# EasyEDA Pro project Module_DIY.eprj

# Schematic Module4_Schematic
Create Date: 2024-08-10; Page Name: P1; Project Name: Module_DIY; Schematic Name: Module4_Schematic; Update Date: 2024-08-10; Company: 嘉立创EDA; Page Size: A4; Version: V1.0
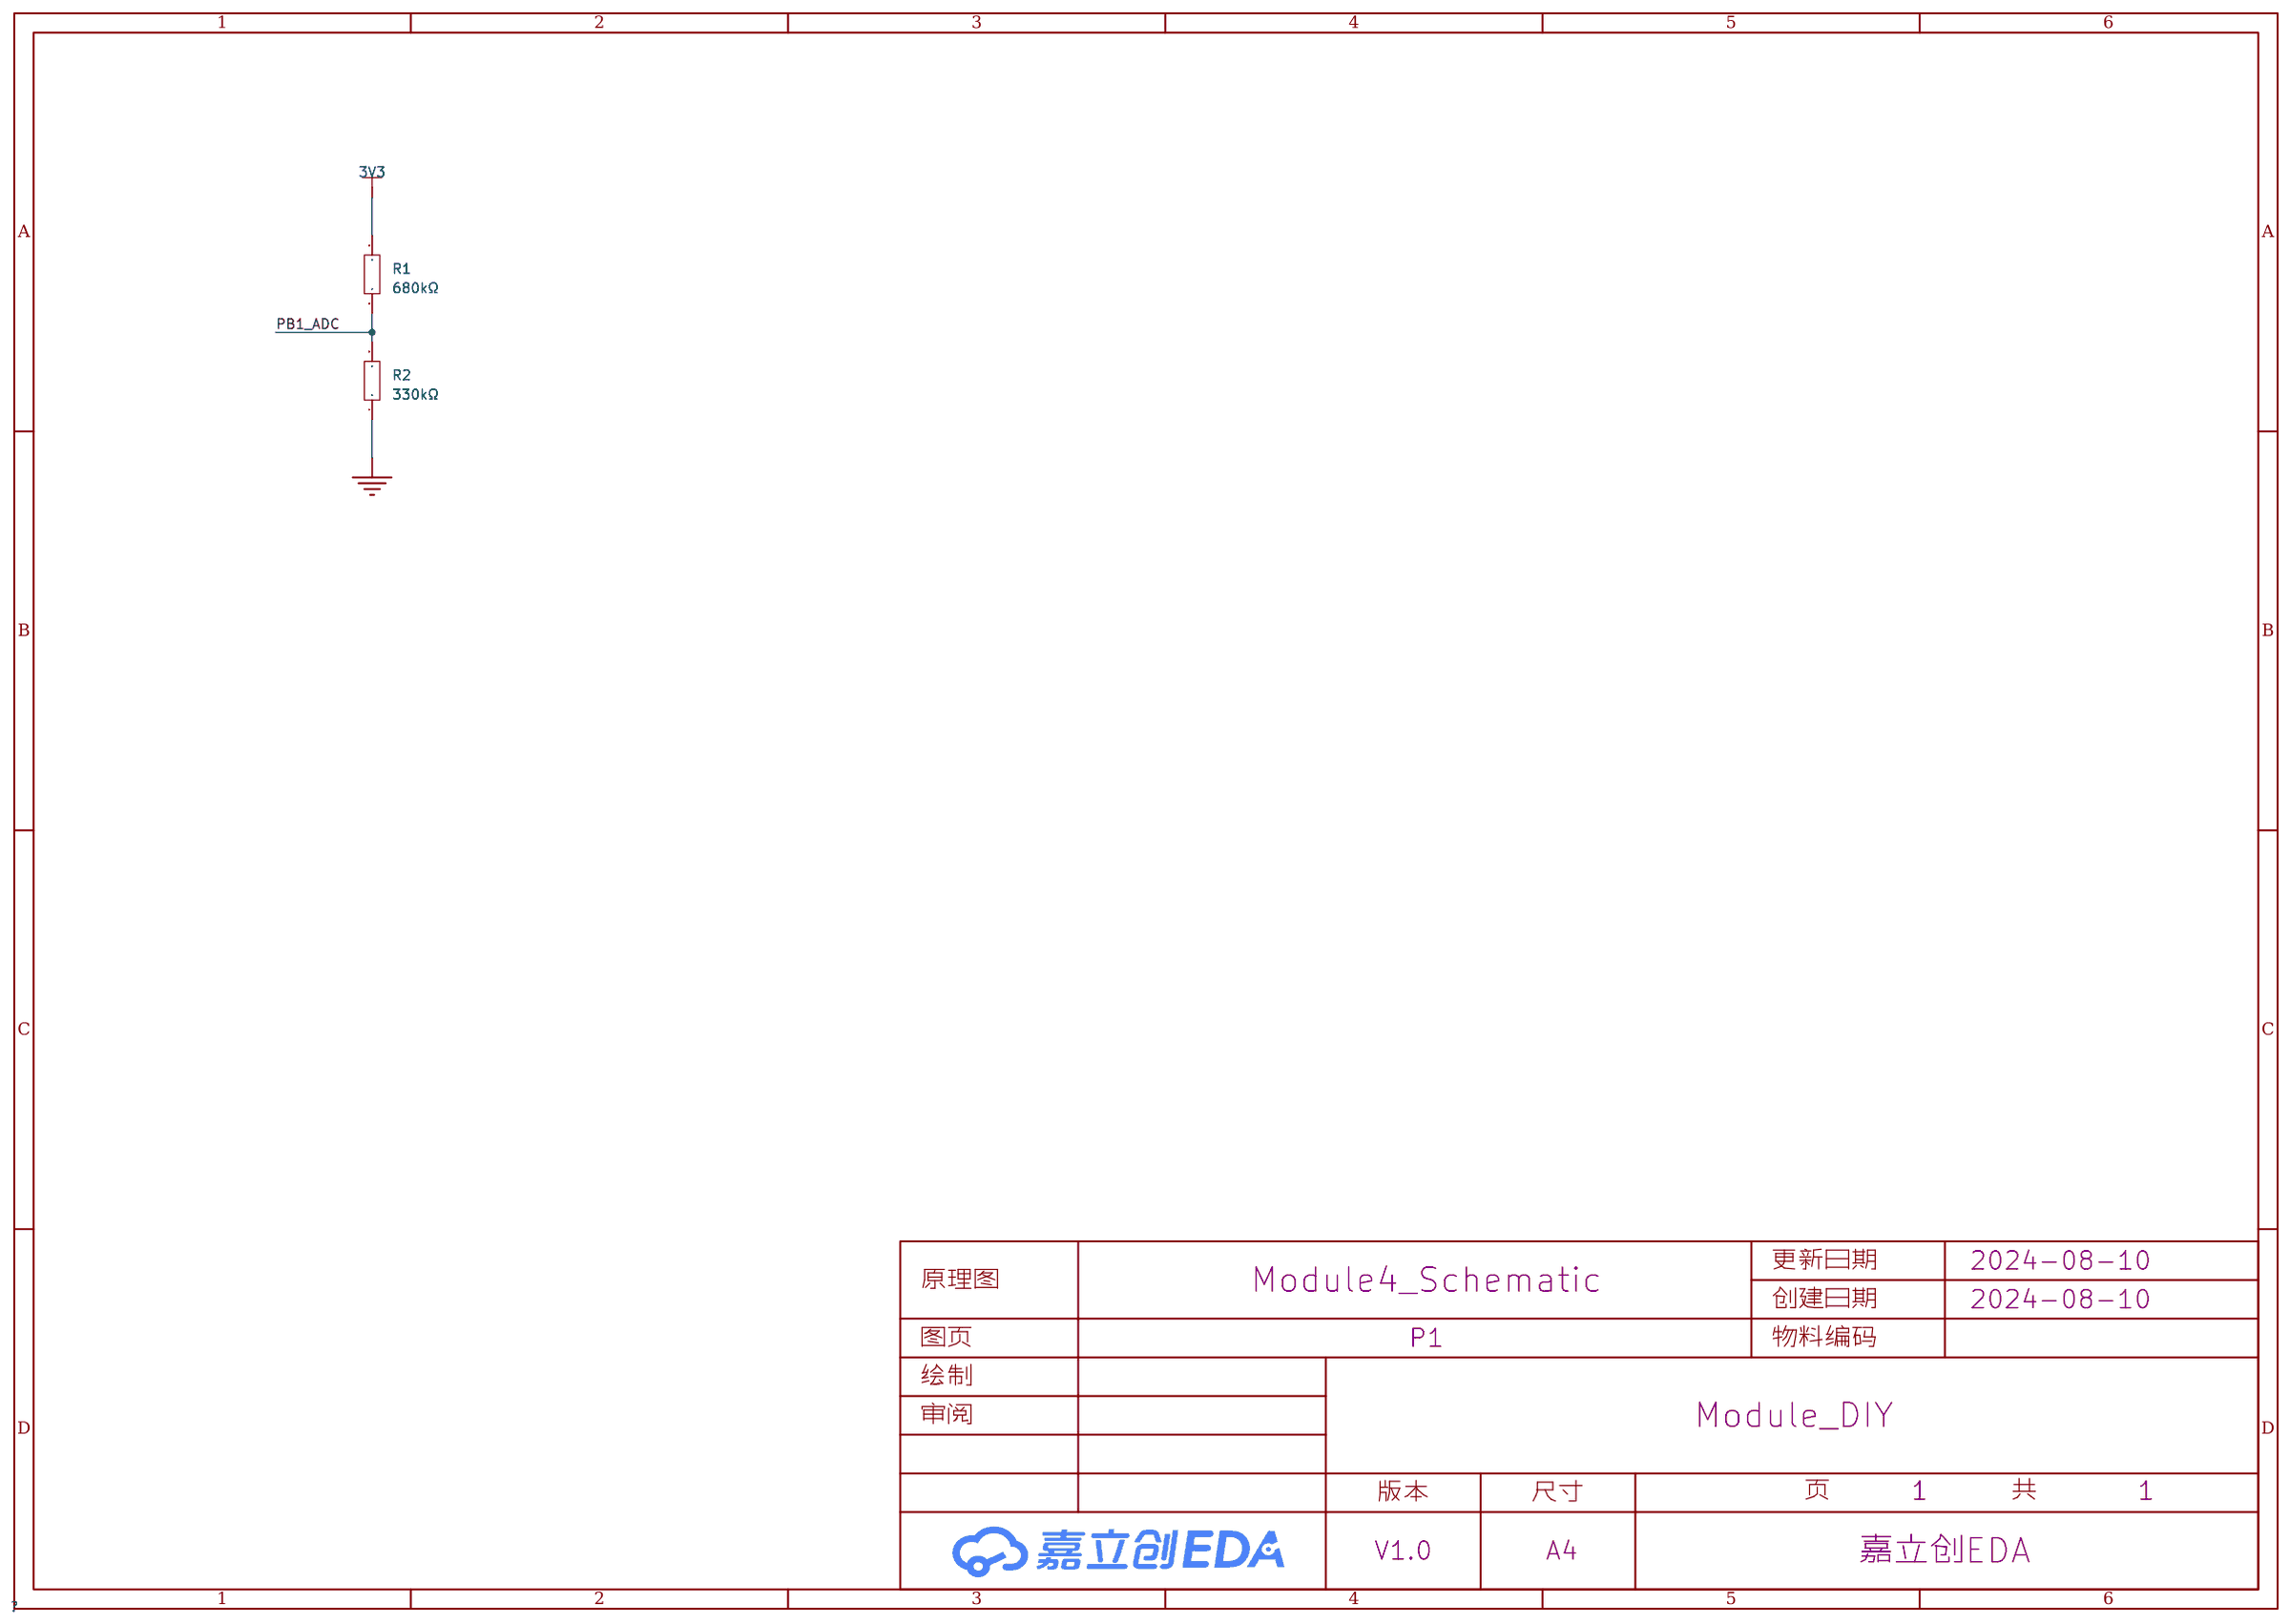
[diagram p0: schematic sheet]

## Parts
R1  680kΩ  [R0603]
R2  330kΩ  [R0603]

## Library data of the parts
R1 R2 = 0603WAF9103T5E: 电阻类型:厚膜电阻;阻值:910kΩ;精度:±1%;功率:100mW;最大工作电压:75V;温度系数:±100ppm/℃;; LCSC Part Name: 910kΩ ±1% 100mW 厚膜电阻; Supplier Part: C23263; Manufacturer: UNI-ROYAL(厚声); Supplier Footprint: 0603; JLCPCB Part Class: 扩展库; Datasheet: https://atta.szlcsc.com/upload/public/pdf/source/20200306/C422600_1E6D84923E4A46A82E41ADD87F860B5C.pdf; Supplier: LCSC; Type: 厚膜电阻; Tolerance: ±1%; Power(Watts): 100mW; Overload Voltage (Max): 75V; Temperature Coefficient: ±100ppm/℃; Operating Temperature Range: -55℃~+155℃

## Nets
3V3: R1.1
GND: R2.1
PB1_ADC: R1.2 R2.2

# Schematic Module5_Schematic
Create Date: 2024-08-10; Page Name: P1; Project Name: Module_DIY; Schematic Name: Module5_Schematic; Update Date: 2024-08-11; Company: 嘉立创EDA; Page Size: A4; Version: V1.0
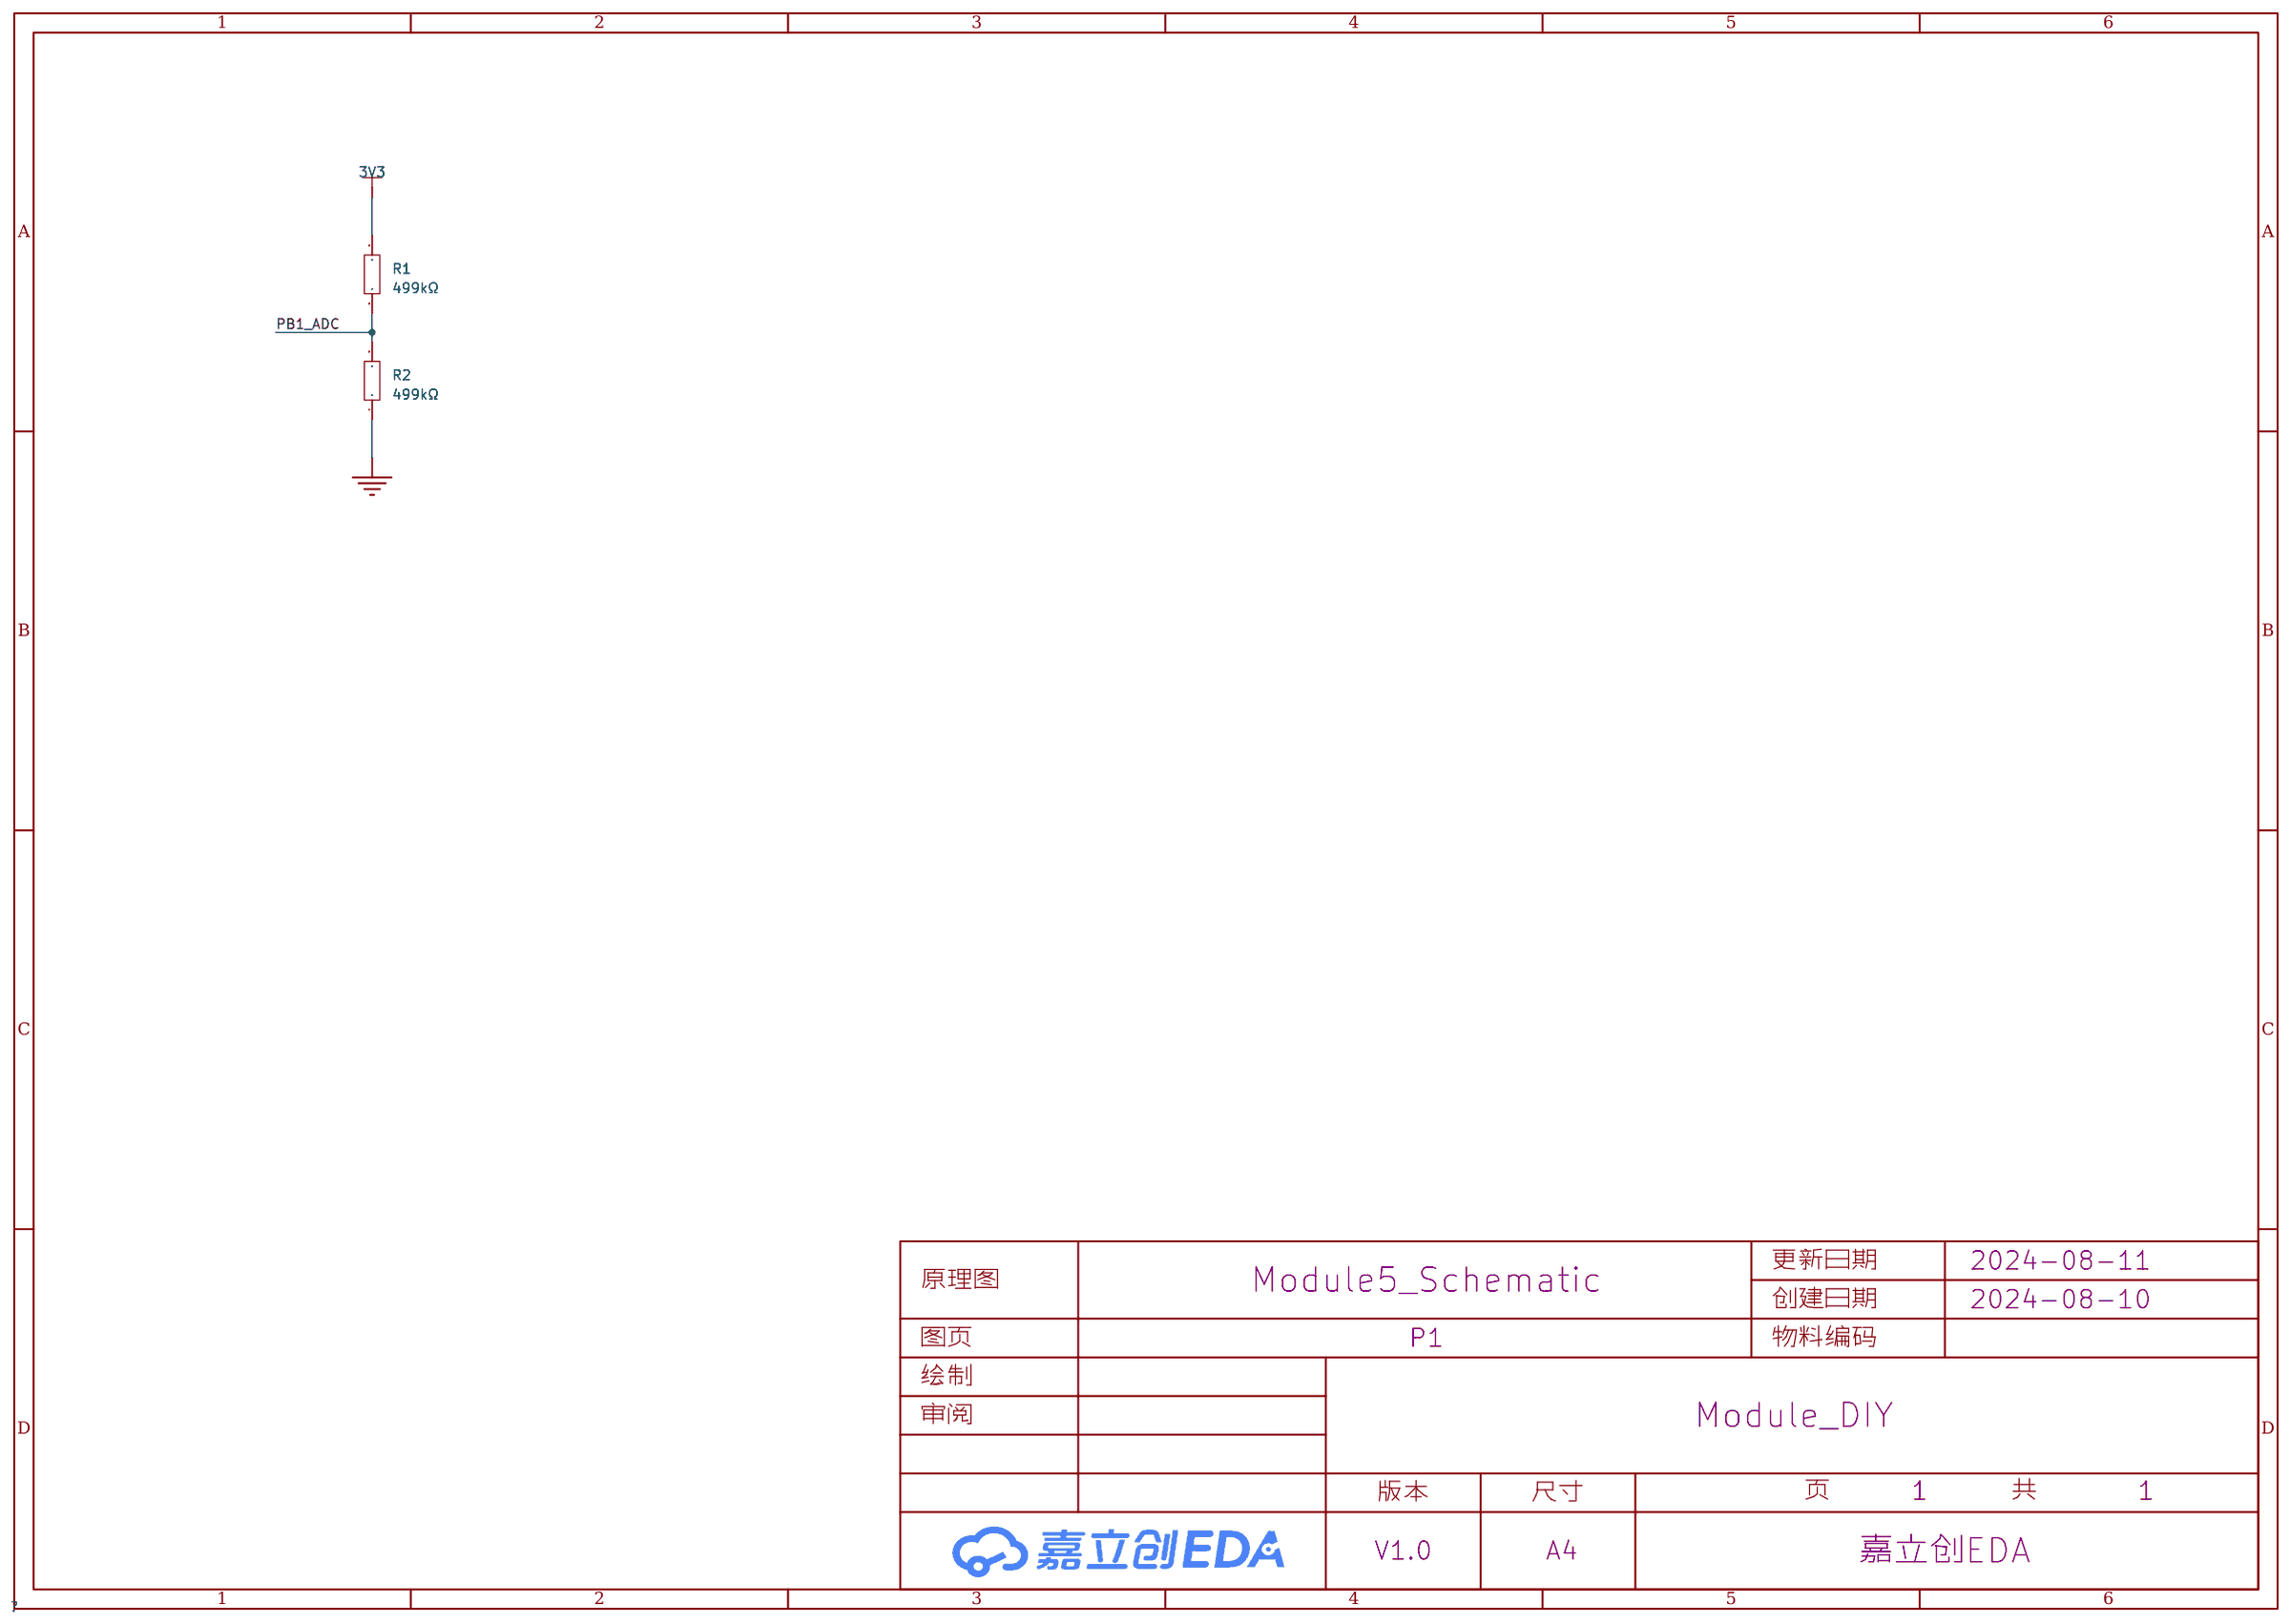
[diagram p1: schematic sheet]

## Parts
R1  499kΩ  [R0603]
R2  499kΩ  [R0603]

## Library data of the parts
R1 R2 = 0603WAF9103T5E: 电阻类型:厚膜电阻;阻值:910kΩ;精度:±1%;功率:100mW;最大工作电压:75V;温度系数:±100ppm/℃;; LCSC Part Name: 910kΩ ±1% 100mW 厚膜电阻; Supplier Part: C23263; Manufacturer: UNI-ROYAL(厚声); Supplier Footprint: 0603; JLCPCB Part Class: 扩展库; Datasheet: https://atta.szlcsc.com/upload/public/pdf/source/20200306/C422600_1E6D84923E4A46A82E41ADD87F860B5C.pdf; Supplier: LCSC; Type: 厚膜电阻; Tolerance: ±1%; Power(Watts): 100mW; Overload Voltage (Max): 75V; Temperature Coefficient: ±100ppm/℃; Operating Temperature Range: -55℃~+155℃

## Nets
3V3: R1.1
GND: R2.1
PB1_ADC: R1.2 R2.2

# Schematic Module6_Schematic
Create Date: 2024-08-10; Page Name: P1; Project Name: Module_DIY; Schematic Name: Module6_Schematic; Update Date: 2024-08-11; Company: 嘉立创EDA; Page Size: A4; Version: V1.0
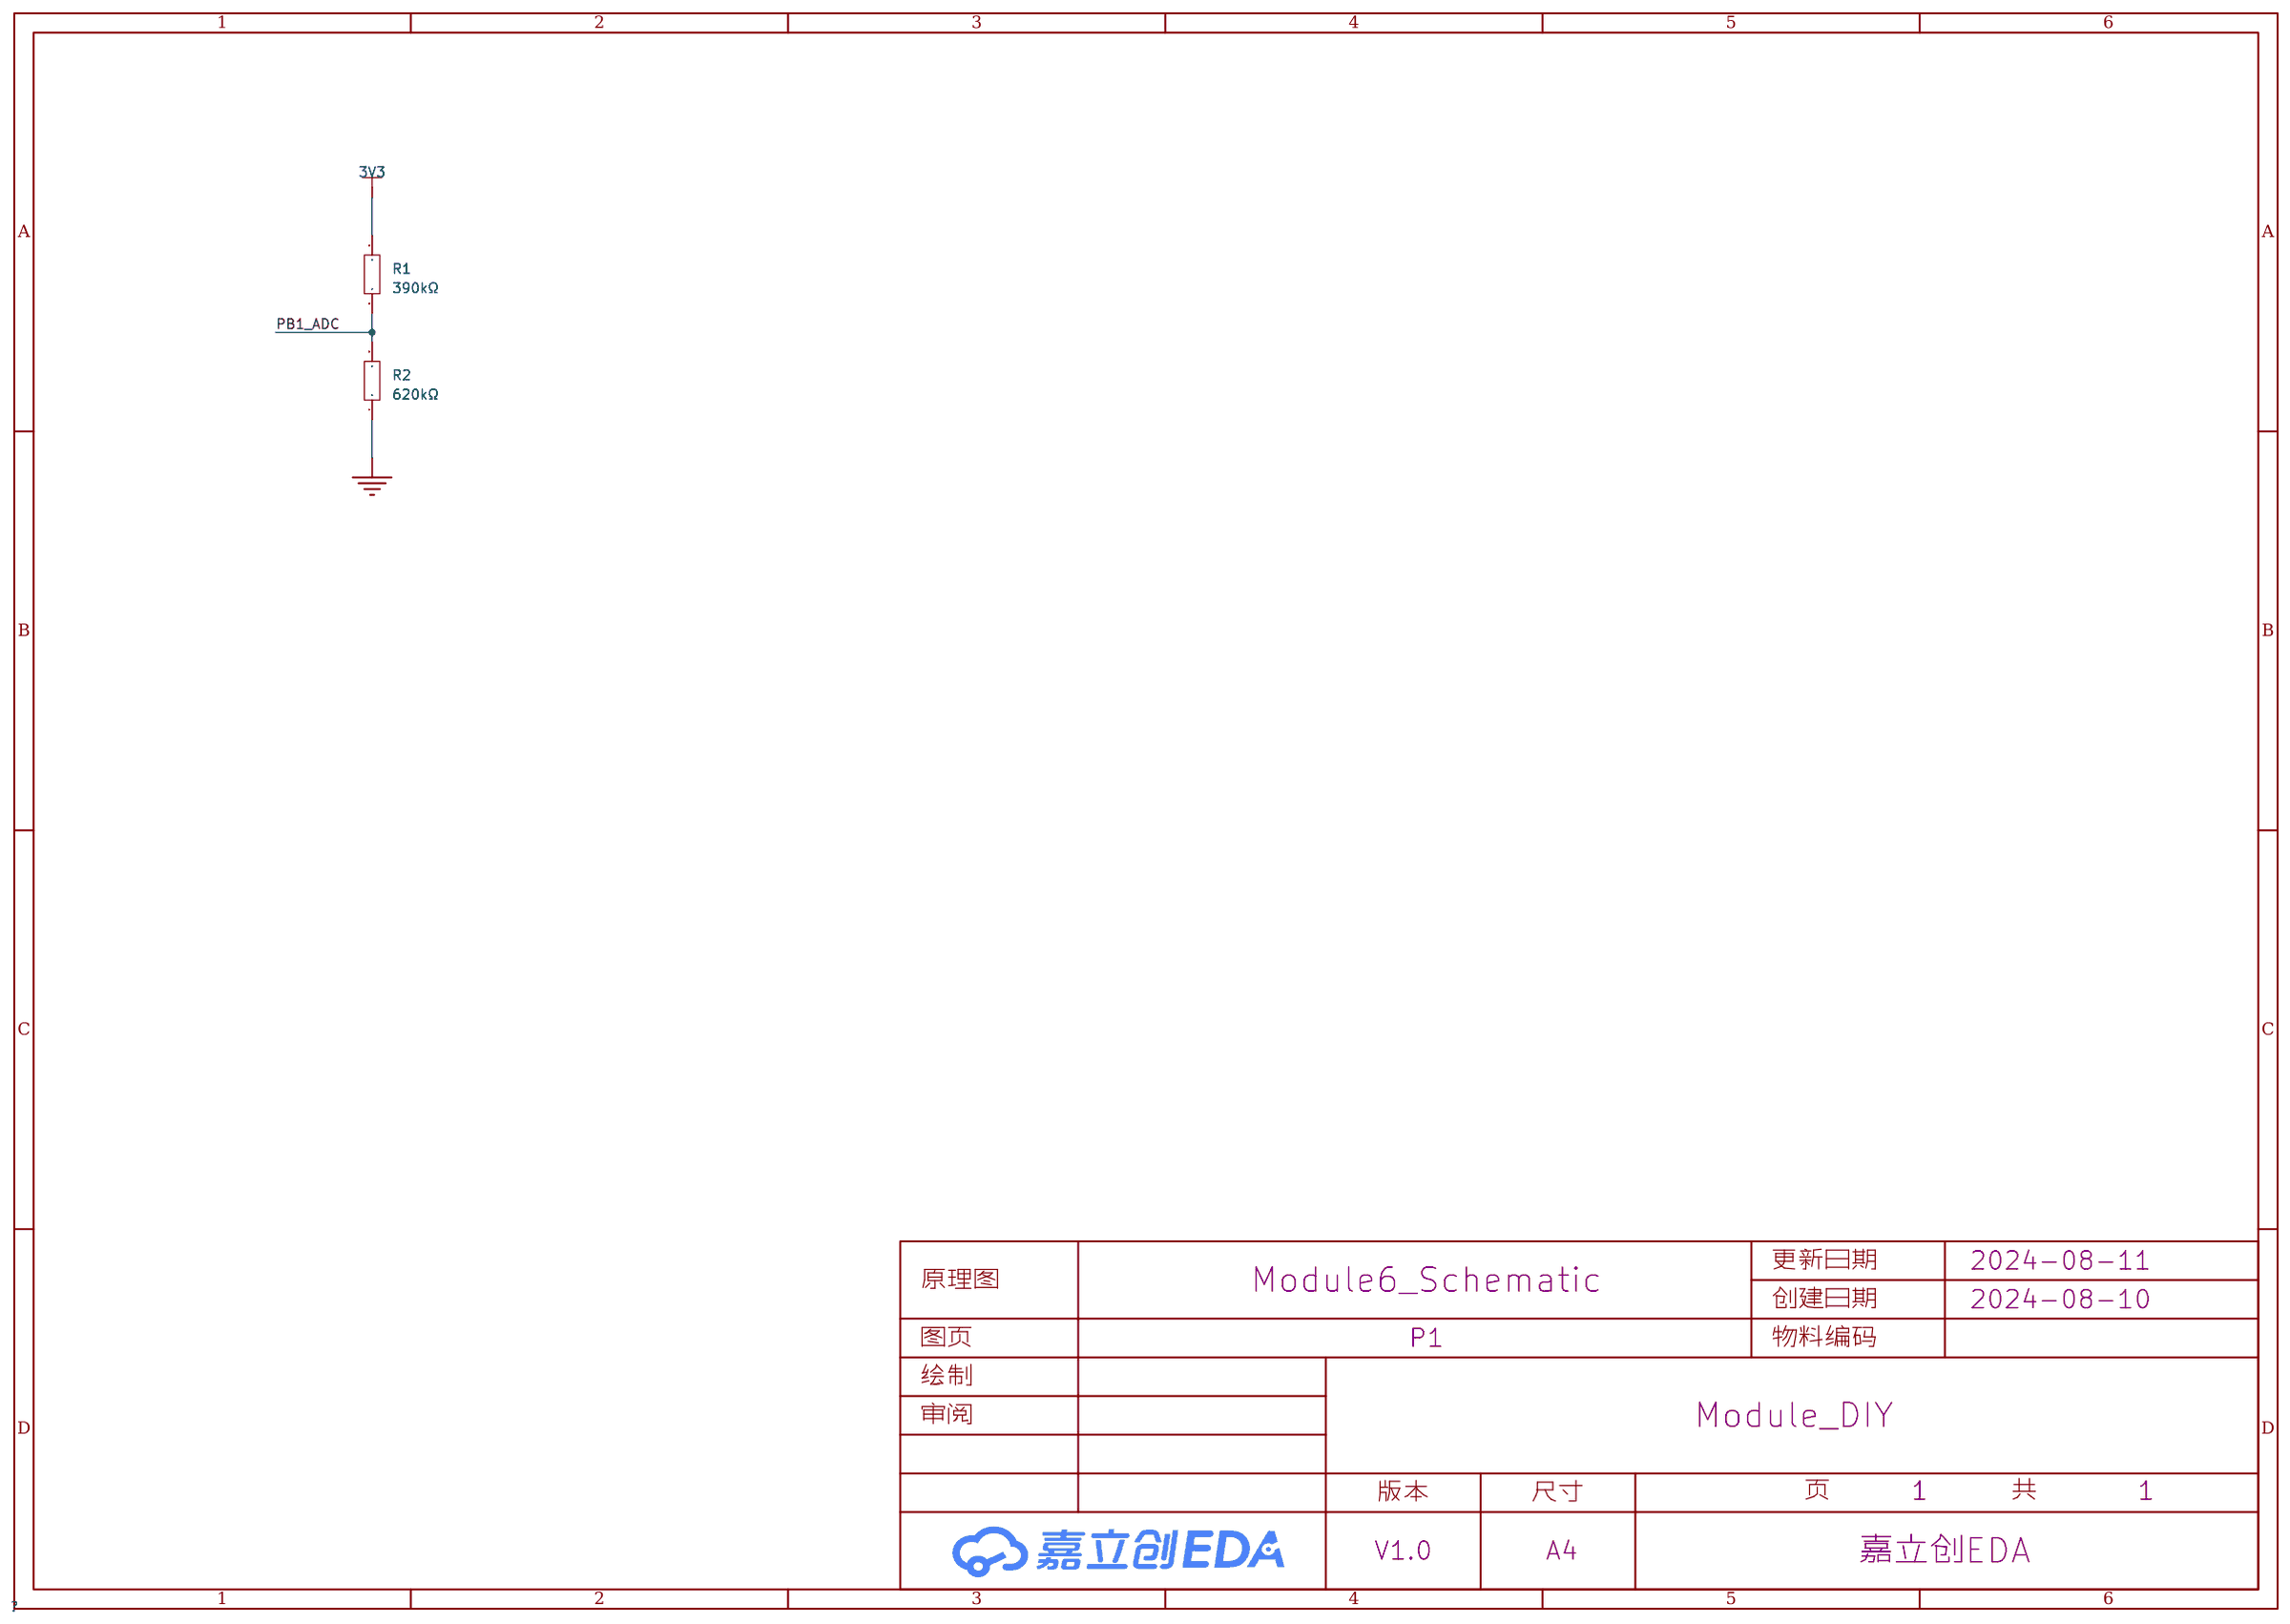
[diagram p2: schematic sheet]

## Parts
R1  390kΩ  [R0603]
R2  620kΩ  [R0603]

## Library data of the parts
R1 R2 = 0603WAF9103T5E: 电阻类型:厚膜电阻;阻值:910kΩ;精度:±1%;功率:100mW;最大工作电压:75V;温度系数:±100ppm/℃;; LCSC Part Name: 910kΩ ±1% 100mW 厚膜电阻; Supplier Part: C23263; Manufacturer: UNI-ROYAL(厚声); Supplier Footprint: 0603; JLCPCB Part Class: 扩展库; Datasheet: https://atta.szlcsc.com/upload/public/pdf/source/20200306/C422600_1E6D84923E4A46A82E41ADD87F860B5C.pdf; Supplier: LCSC; Type: 厚膜电阻; Tolerance: ±1%; Power(Watts): 100mW; Overload Voltage (Max): 75V; Temperature Coefficient: ±100ppm/℃; Operating Temperature Range: -55℃~+155℃

## Nets
3V3: R1.1
GND: R2.1
PB1_ADC: R1.2 R2.2

# Schematic Module7_Schematic
Create Date: 2024-08-10; Page Name: P1; Project Name: Module_DIY; Schematic Name: Module7_Schematic; Update Date: 2024-08-11; Company: 嘉立创EDA; Page Size: A4; Version: V1.0
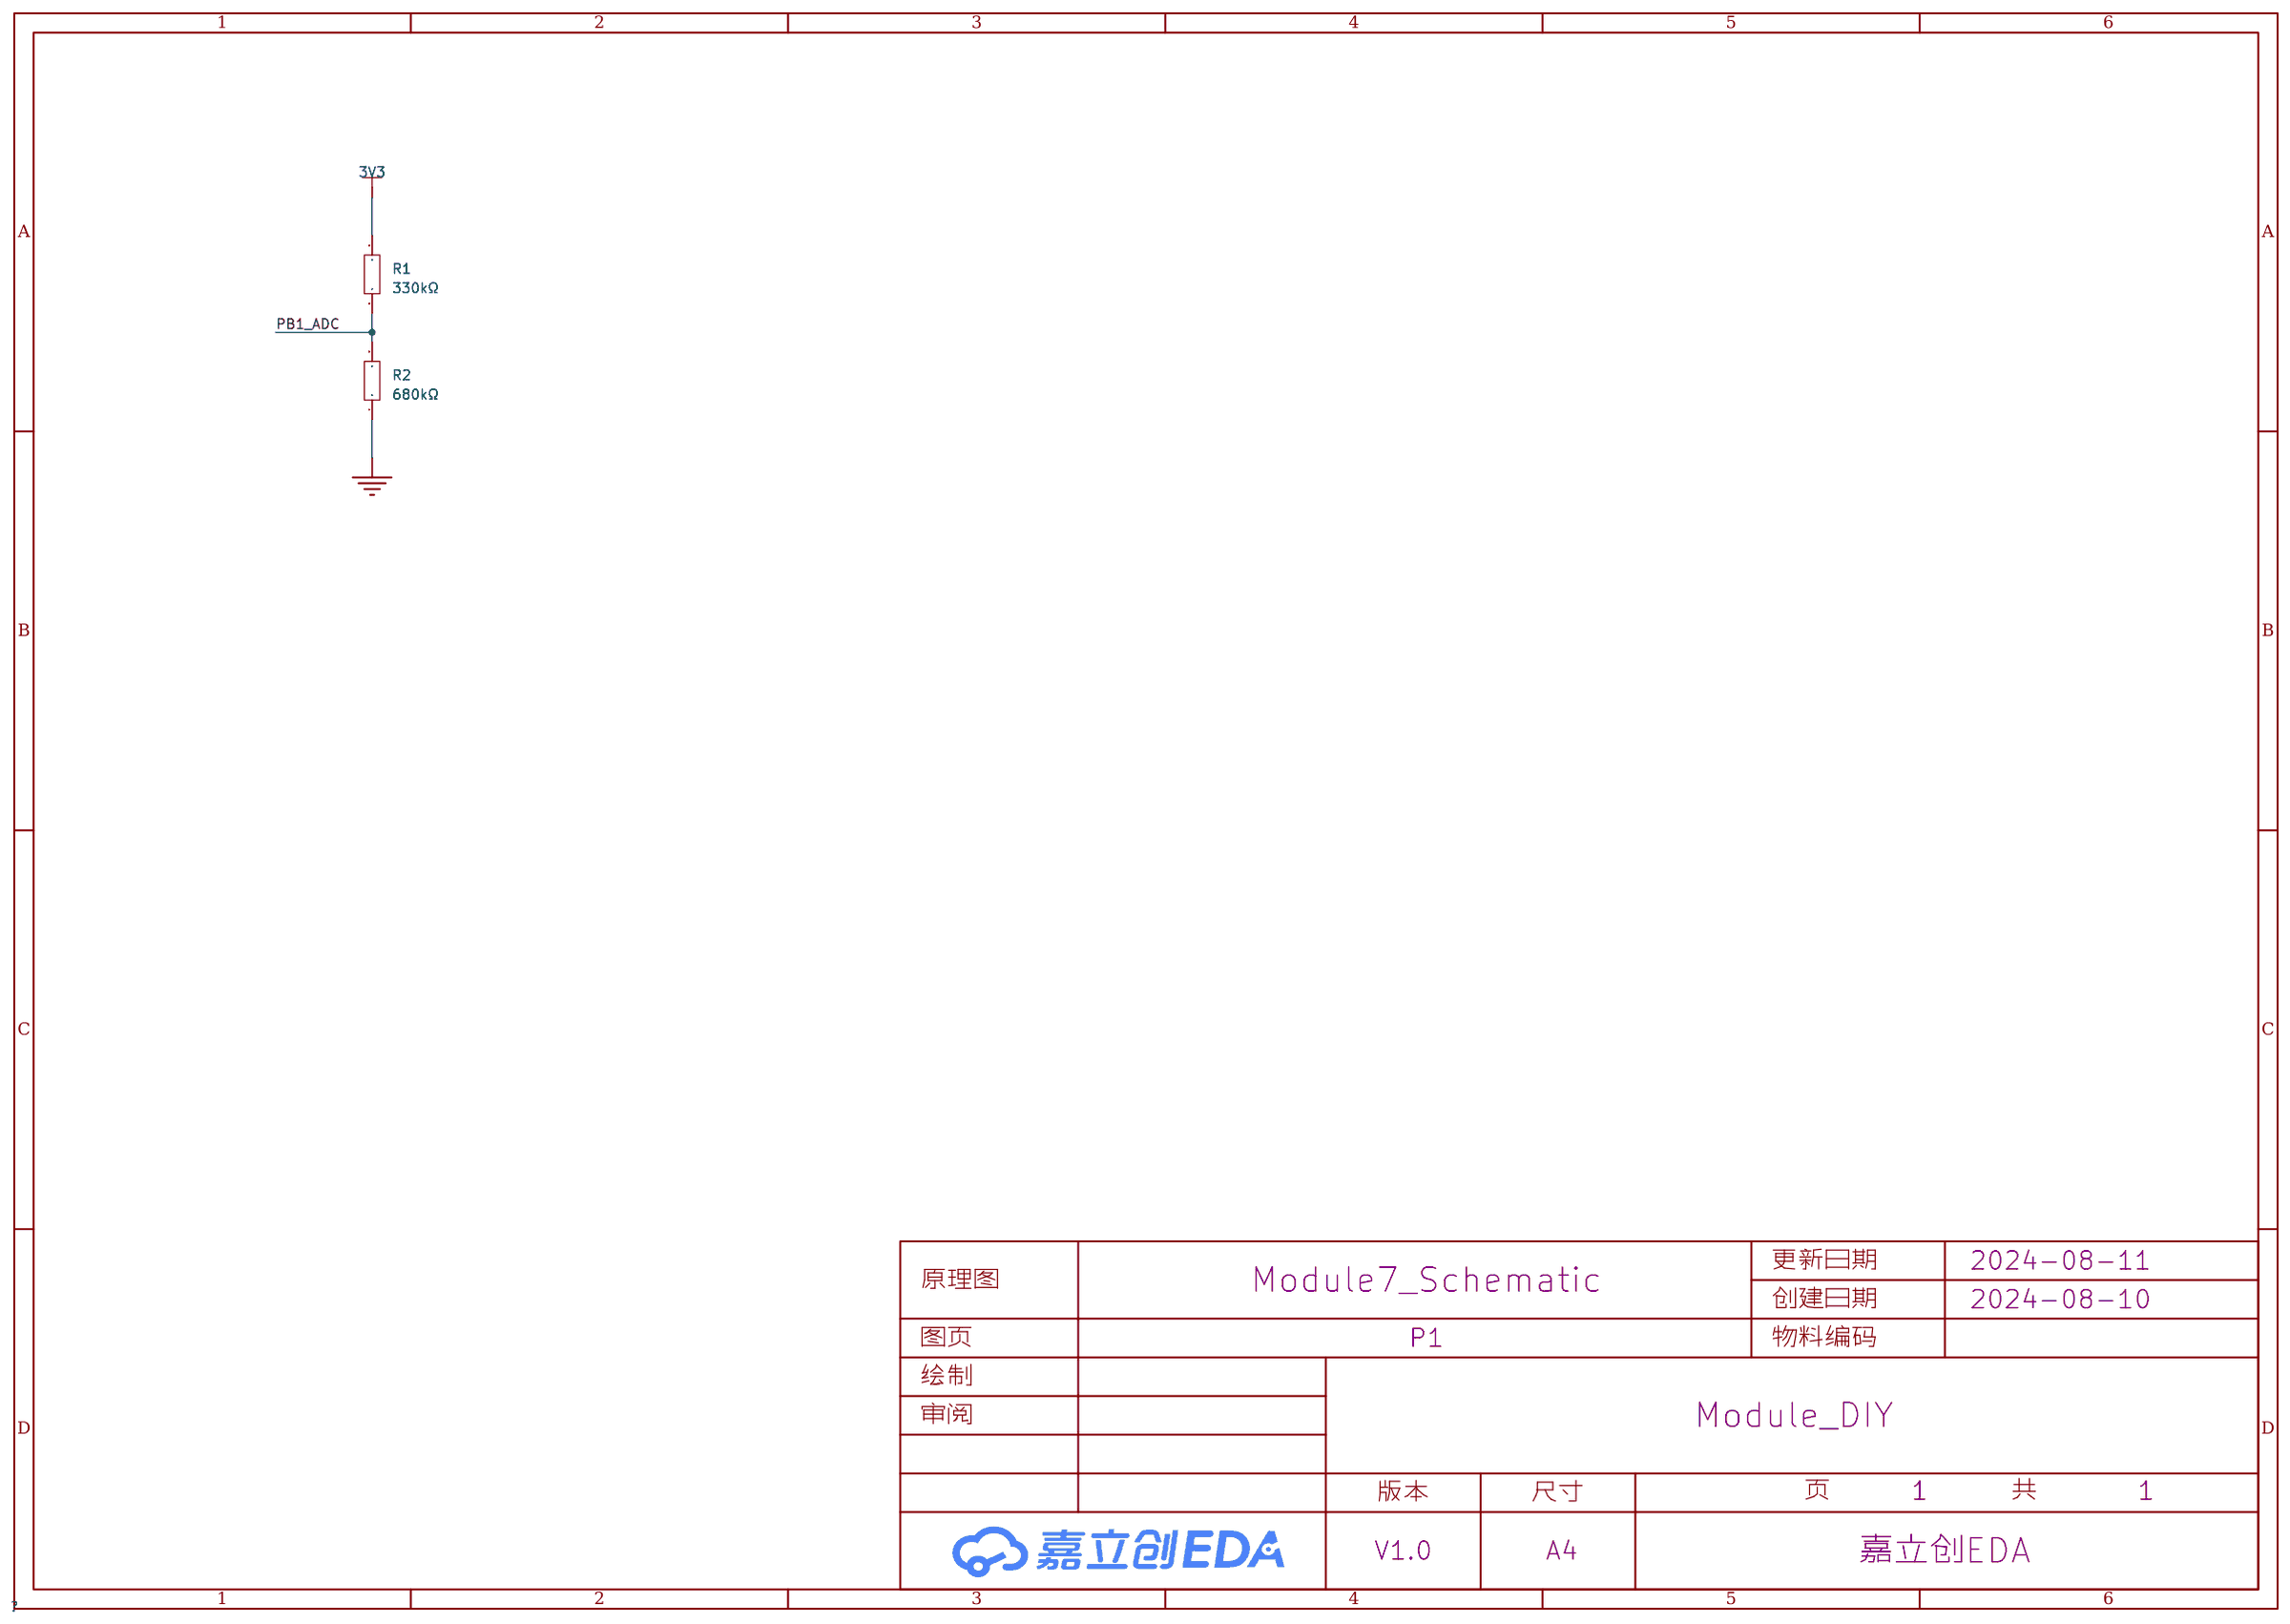
[diagram p3: schematic sheet]

## Parts
R1  330kΩ  [R0603]
R2  680kΩ  [R0603]

## Library data of the parts
R1 R2 = 0603WAF9103T5E: 电阻类型:厚膜电阻;阻值:910kΩ;精度:±1%;功率:100mW;最大工作电压:75V;温度系数:±100ppm/℃;; LCSC Part Name: 910kΩ ±1% 100mW 厚膜电阻; Supplier Part: C23263; Manufacturer: UNI-ROYAL(厚声); Supplier Footprint: 0603; JLCPCB Part Class: 扩展库; Datasheet: https://atta.szlcsc.com/upload/public/pdf/source/20200306/C422600_1E6D84923E4A46A82E41ADD87F860B5C.pdf; Supplier: LCSC; Type: 厚膜电阻; Tolerance: ±1%; Power(Watts): 100mW; Overload Voltage (Max): 75V; Temperature Coefficient: ±100ppm/℃; Operating Temperature Range: -55℃~+155℃

## Nets
3V3: R1.1
GND: R2.1
PB1_ADC: R1.2 R2.2

# Schematic Module8_Schematic
Create Date: 2024-08-10; Page Name: P1; Project Name: Module_DIY; Schematic Name: Module8_Schematic; Update Date: 2024-08-11; Company: 嘉立创EDA; Page Size: A4; Version: V1.0
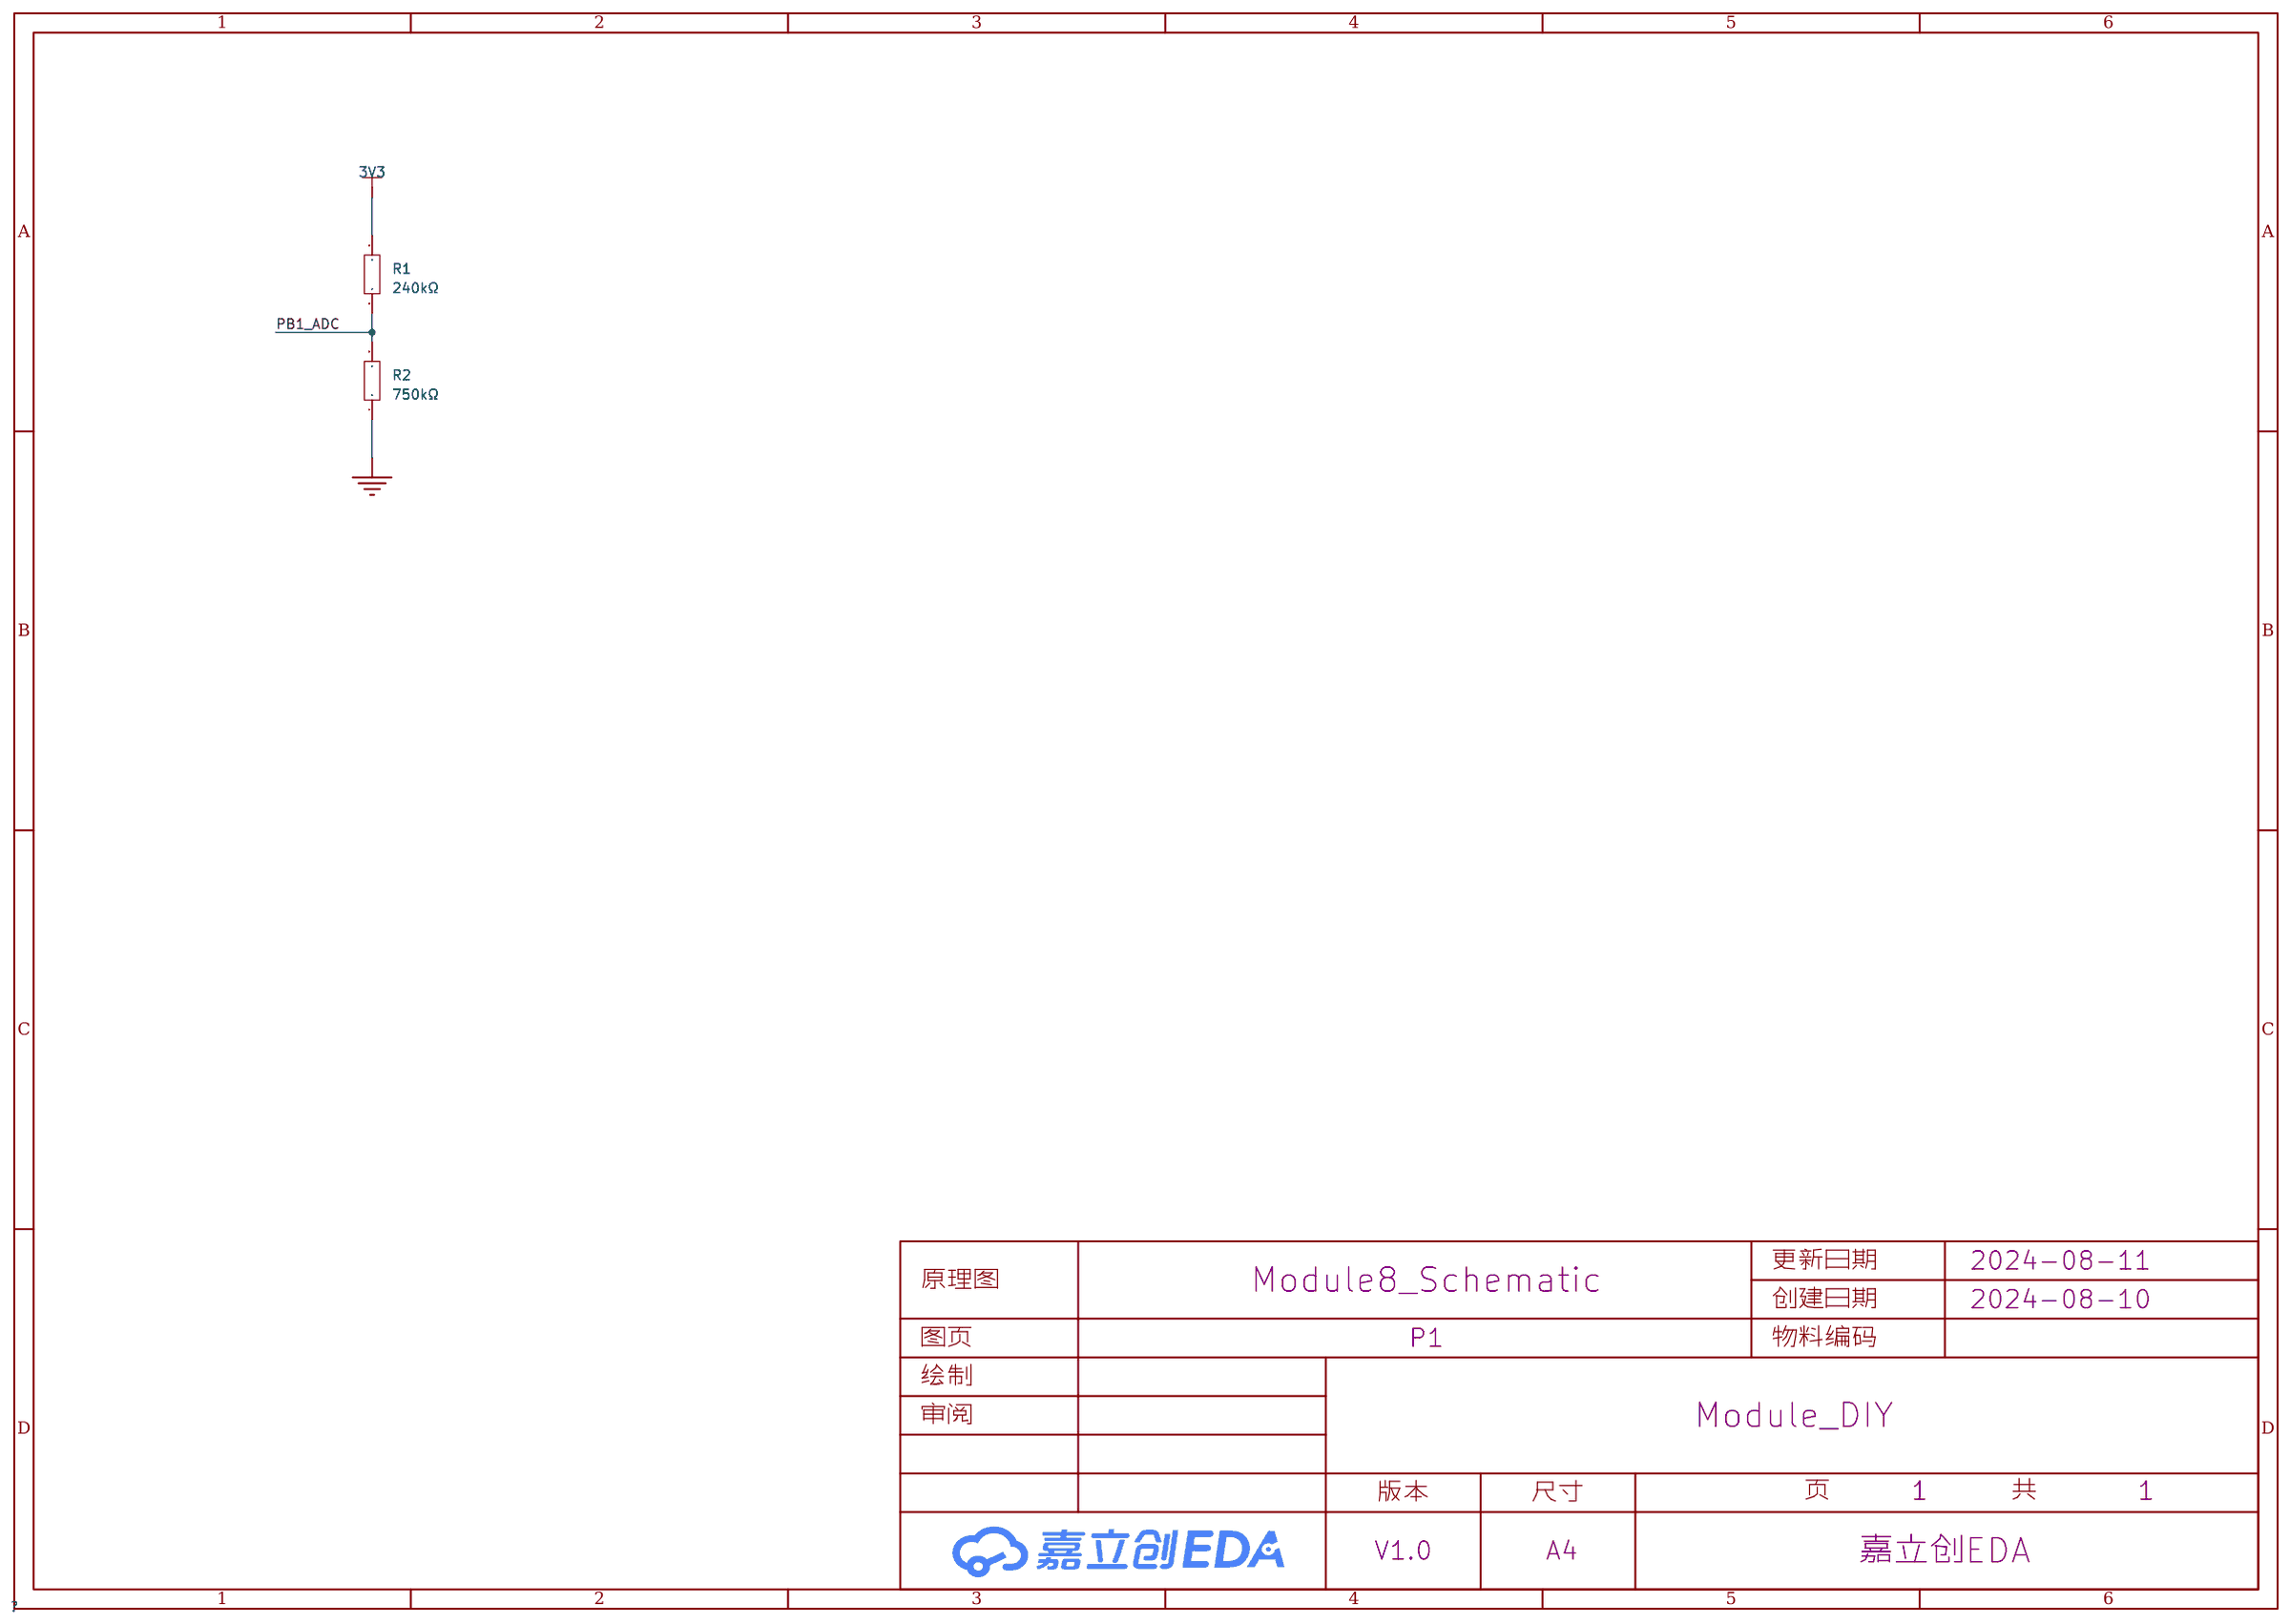
[diagram p4: schematic sheet]

## Parts
R1  240kΩ  [R0603]
R2  750kΩ  [R0603]

## Library data of the parts
R1 R2 = 0603WAF9103T5E: 电阻类型:厚膜电阻;阻值:910kΩ;精度:±1%;功率:100mW;最大工作电压:75V;温度系数:±100ppm/℃;; LCSC Part Name: 910kΩ ±1% 100mW 厚膜电阻; Supplier Part: C23263; Manufacturer: UNI-ROYAL(厚声); Supplier Footprint: 0603; JLCPCB Part Class: 扩展库; Datasheet: https://atta.szlcsc.com/upload/public/pdf/source/20200306/C422600_1E6D84923E4A46A82E41ADD87F860B5C.pdf; Supplier: LCSC; Type: 厚膜电阻; Tolerance: ±1%; Power(Watts): 100mW; Overload Voltage (Max): 75V; Temperature Coefficient: ±100ppm/℃; Operating Temperature Range: -55℃~+155℃

## Nets
3V3: R1.1
GND: R2.1
PB1_ADC: R1.2 R2.2

# Schematic Module9_Schematic
Create Date: 2024-08-10; Page Name: P1; Project Name: Module_DIY; Schematic Name: Module9_Schematic; Update Date: 2024-08-11; Company: 嘉立创EDA; Page Size: A4; Version: V1.0
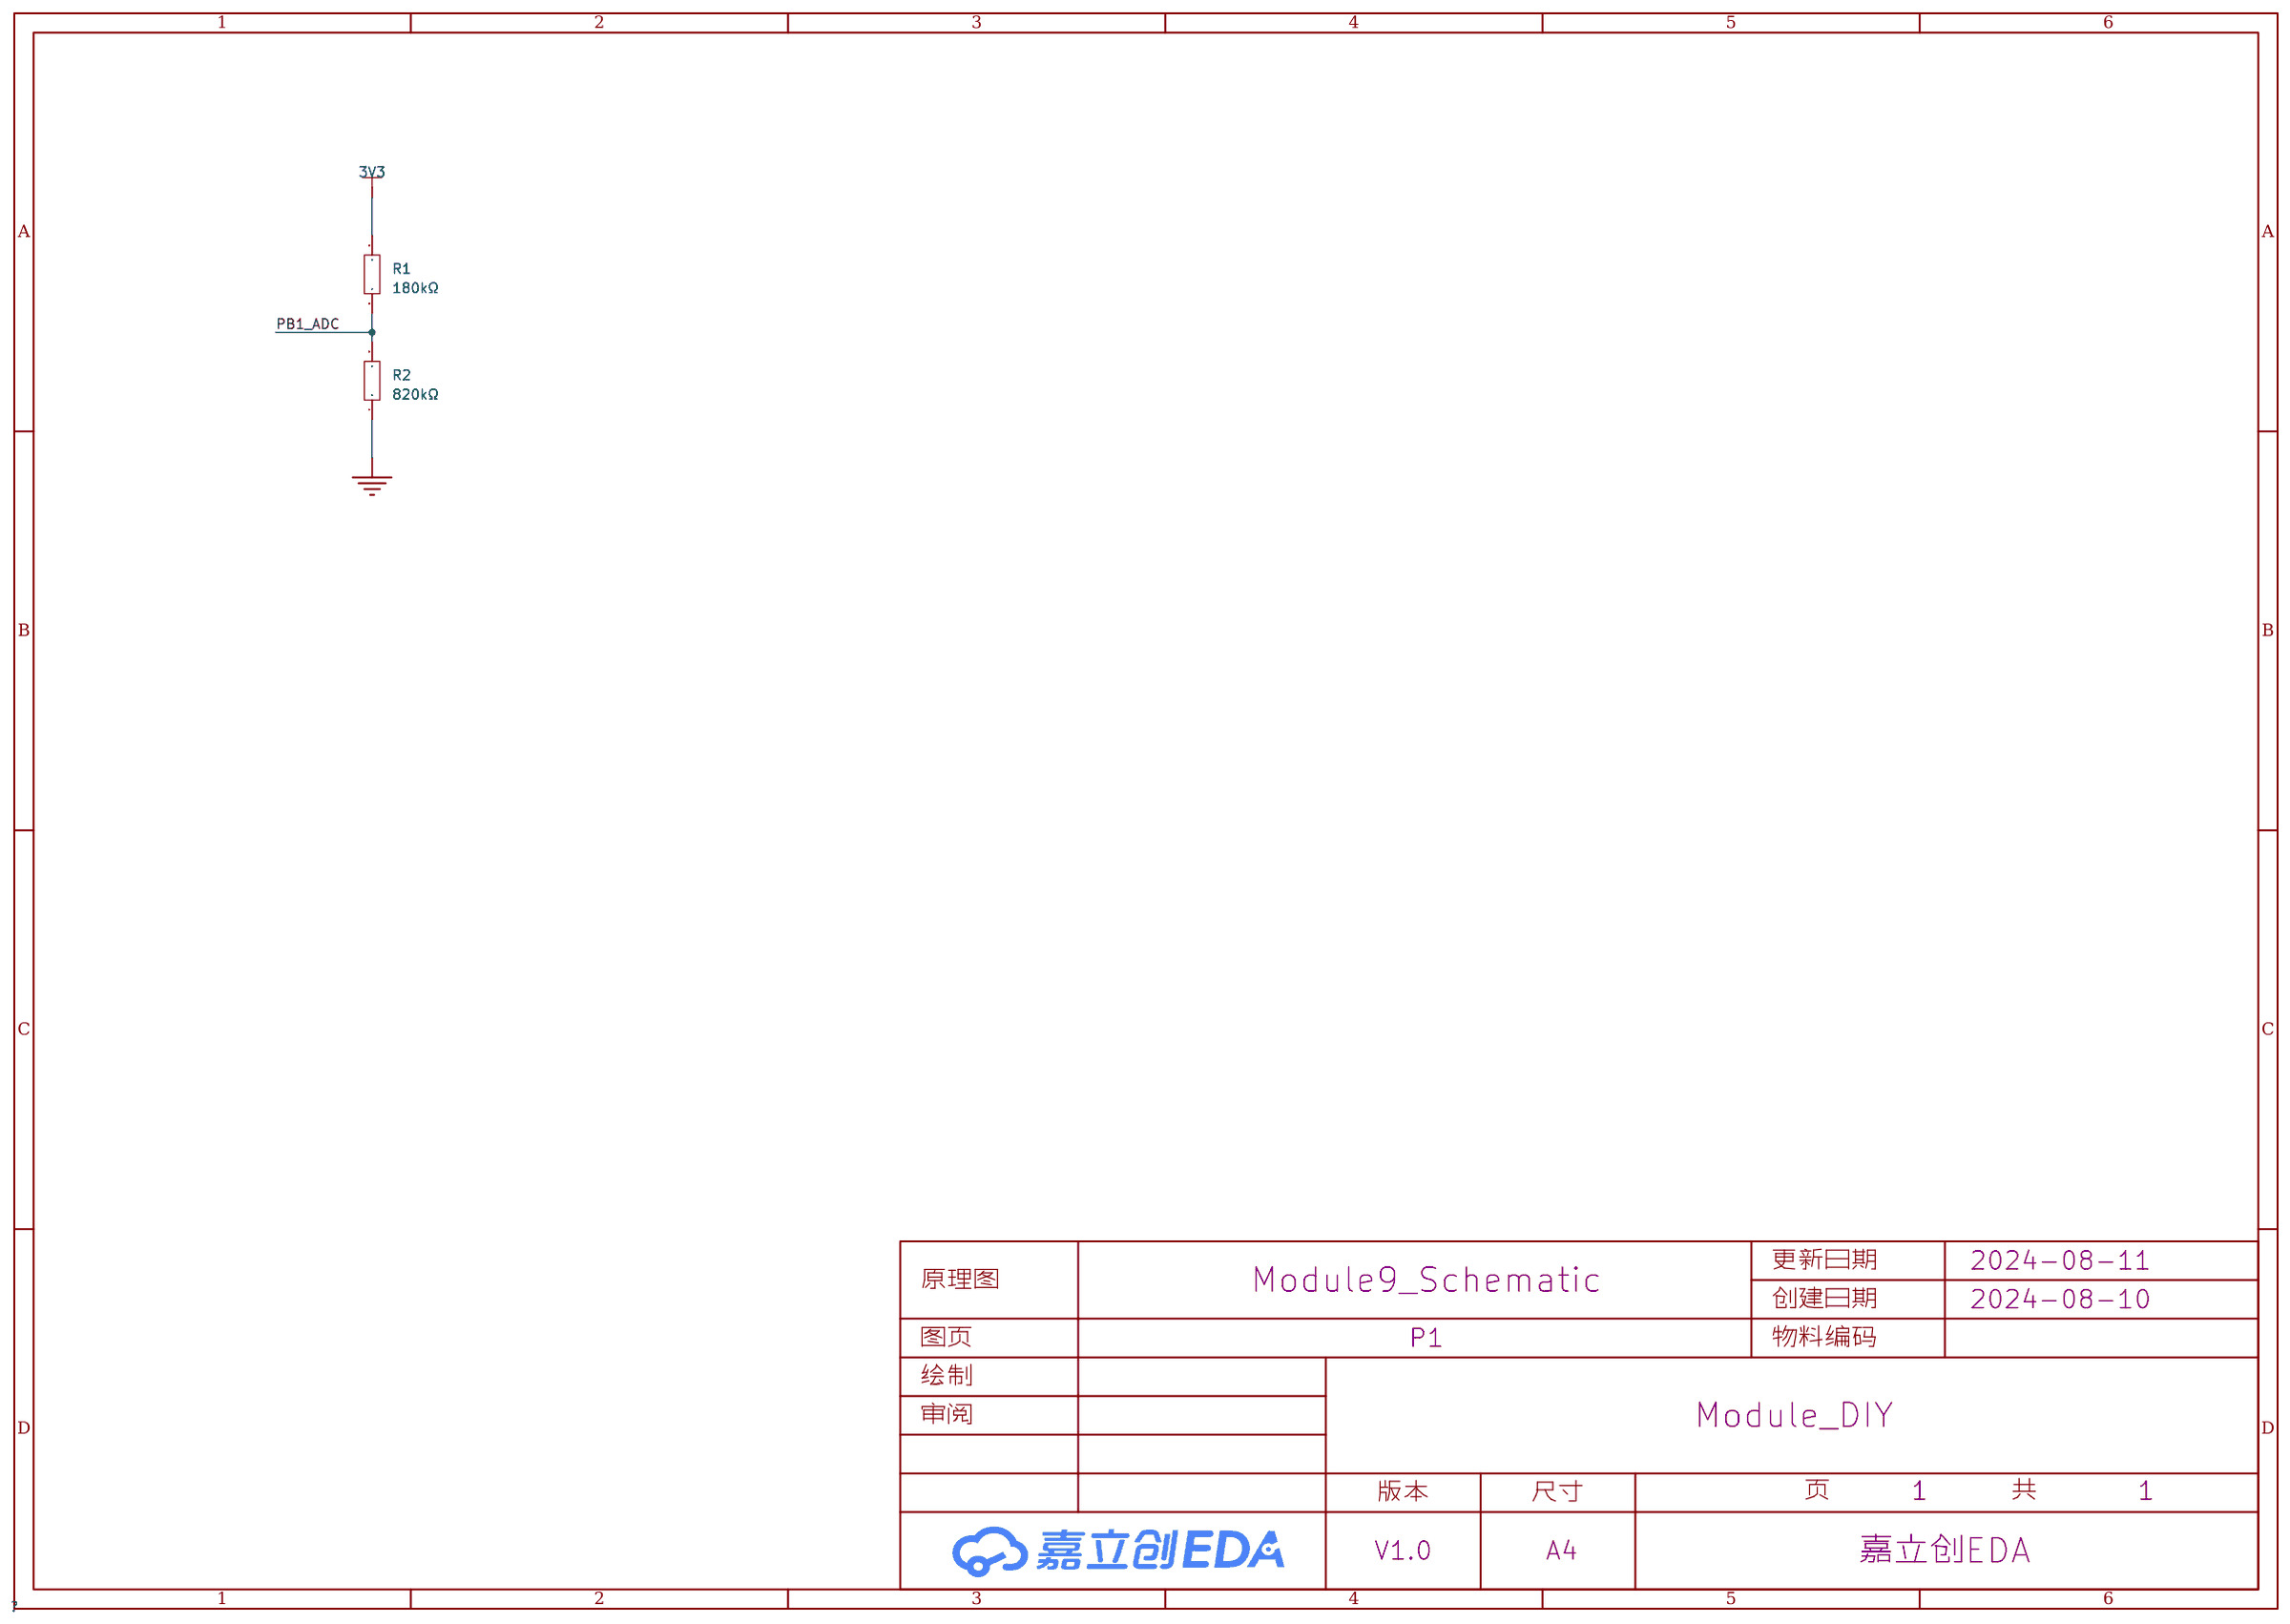
[diagram p5: schematic sheet]

## Parts
R1  180kΩ  [R0603]
R2  820kΩ  [R0603]

## Library data of the parts
R1 R2 = 0603WAF9103T5E: 电阻类型:厚膜电阻;阻值:910kΩ;精度:±1%;功率:100mW;最大工作电压:75V;温度系数:±100ppm/℃;; LCSC Part Name: 910kΩ ±1% 100mW 厚膜电阻; Supplier Part: C23263; Manufacturer: UNI-ROYAL(厚声); Supplier Footprint: 0603; JLCPCB Part Class: 扩展库; Datasheet: https://atta.szlcsc.com/upload/public/pdf/source/20200306/C422600_1E6D84923E4A46A82E41ADD87F860B5C.pdf; Supplier: LCSC; Type: 厚膜电阻; Tolerance: ±1%; Power(Watts): 100mW; Overload Voltage (Max): 75V; Temperature Coefficient: ±100ppm/℃; Operating Temperature Range: -55℃~+155℃

## Nets
3V3: R1.1
GND: R2.1
PB1_ADC: R1.2 R2.2

# Schematic Module10_Schematic
Create Date: 2024-08-10; Page Name: P1; Project Name: Module_DIY; Schematic Name: Module10_Schematic; Update Date: 2024-08-11; Company: 嘉立创EDA; Page Size: A4; Version: V1.0
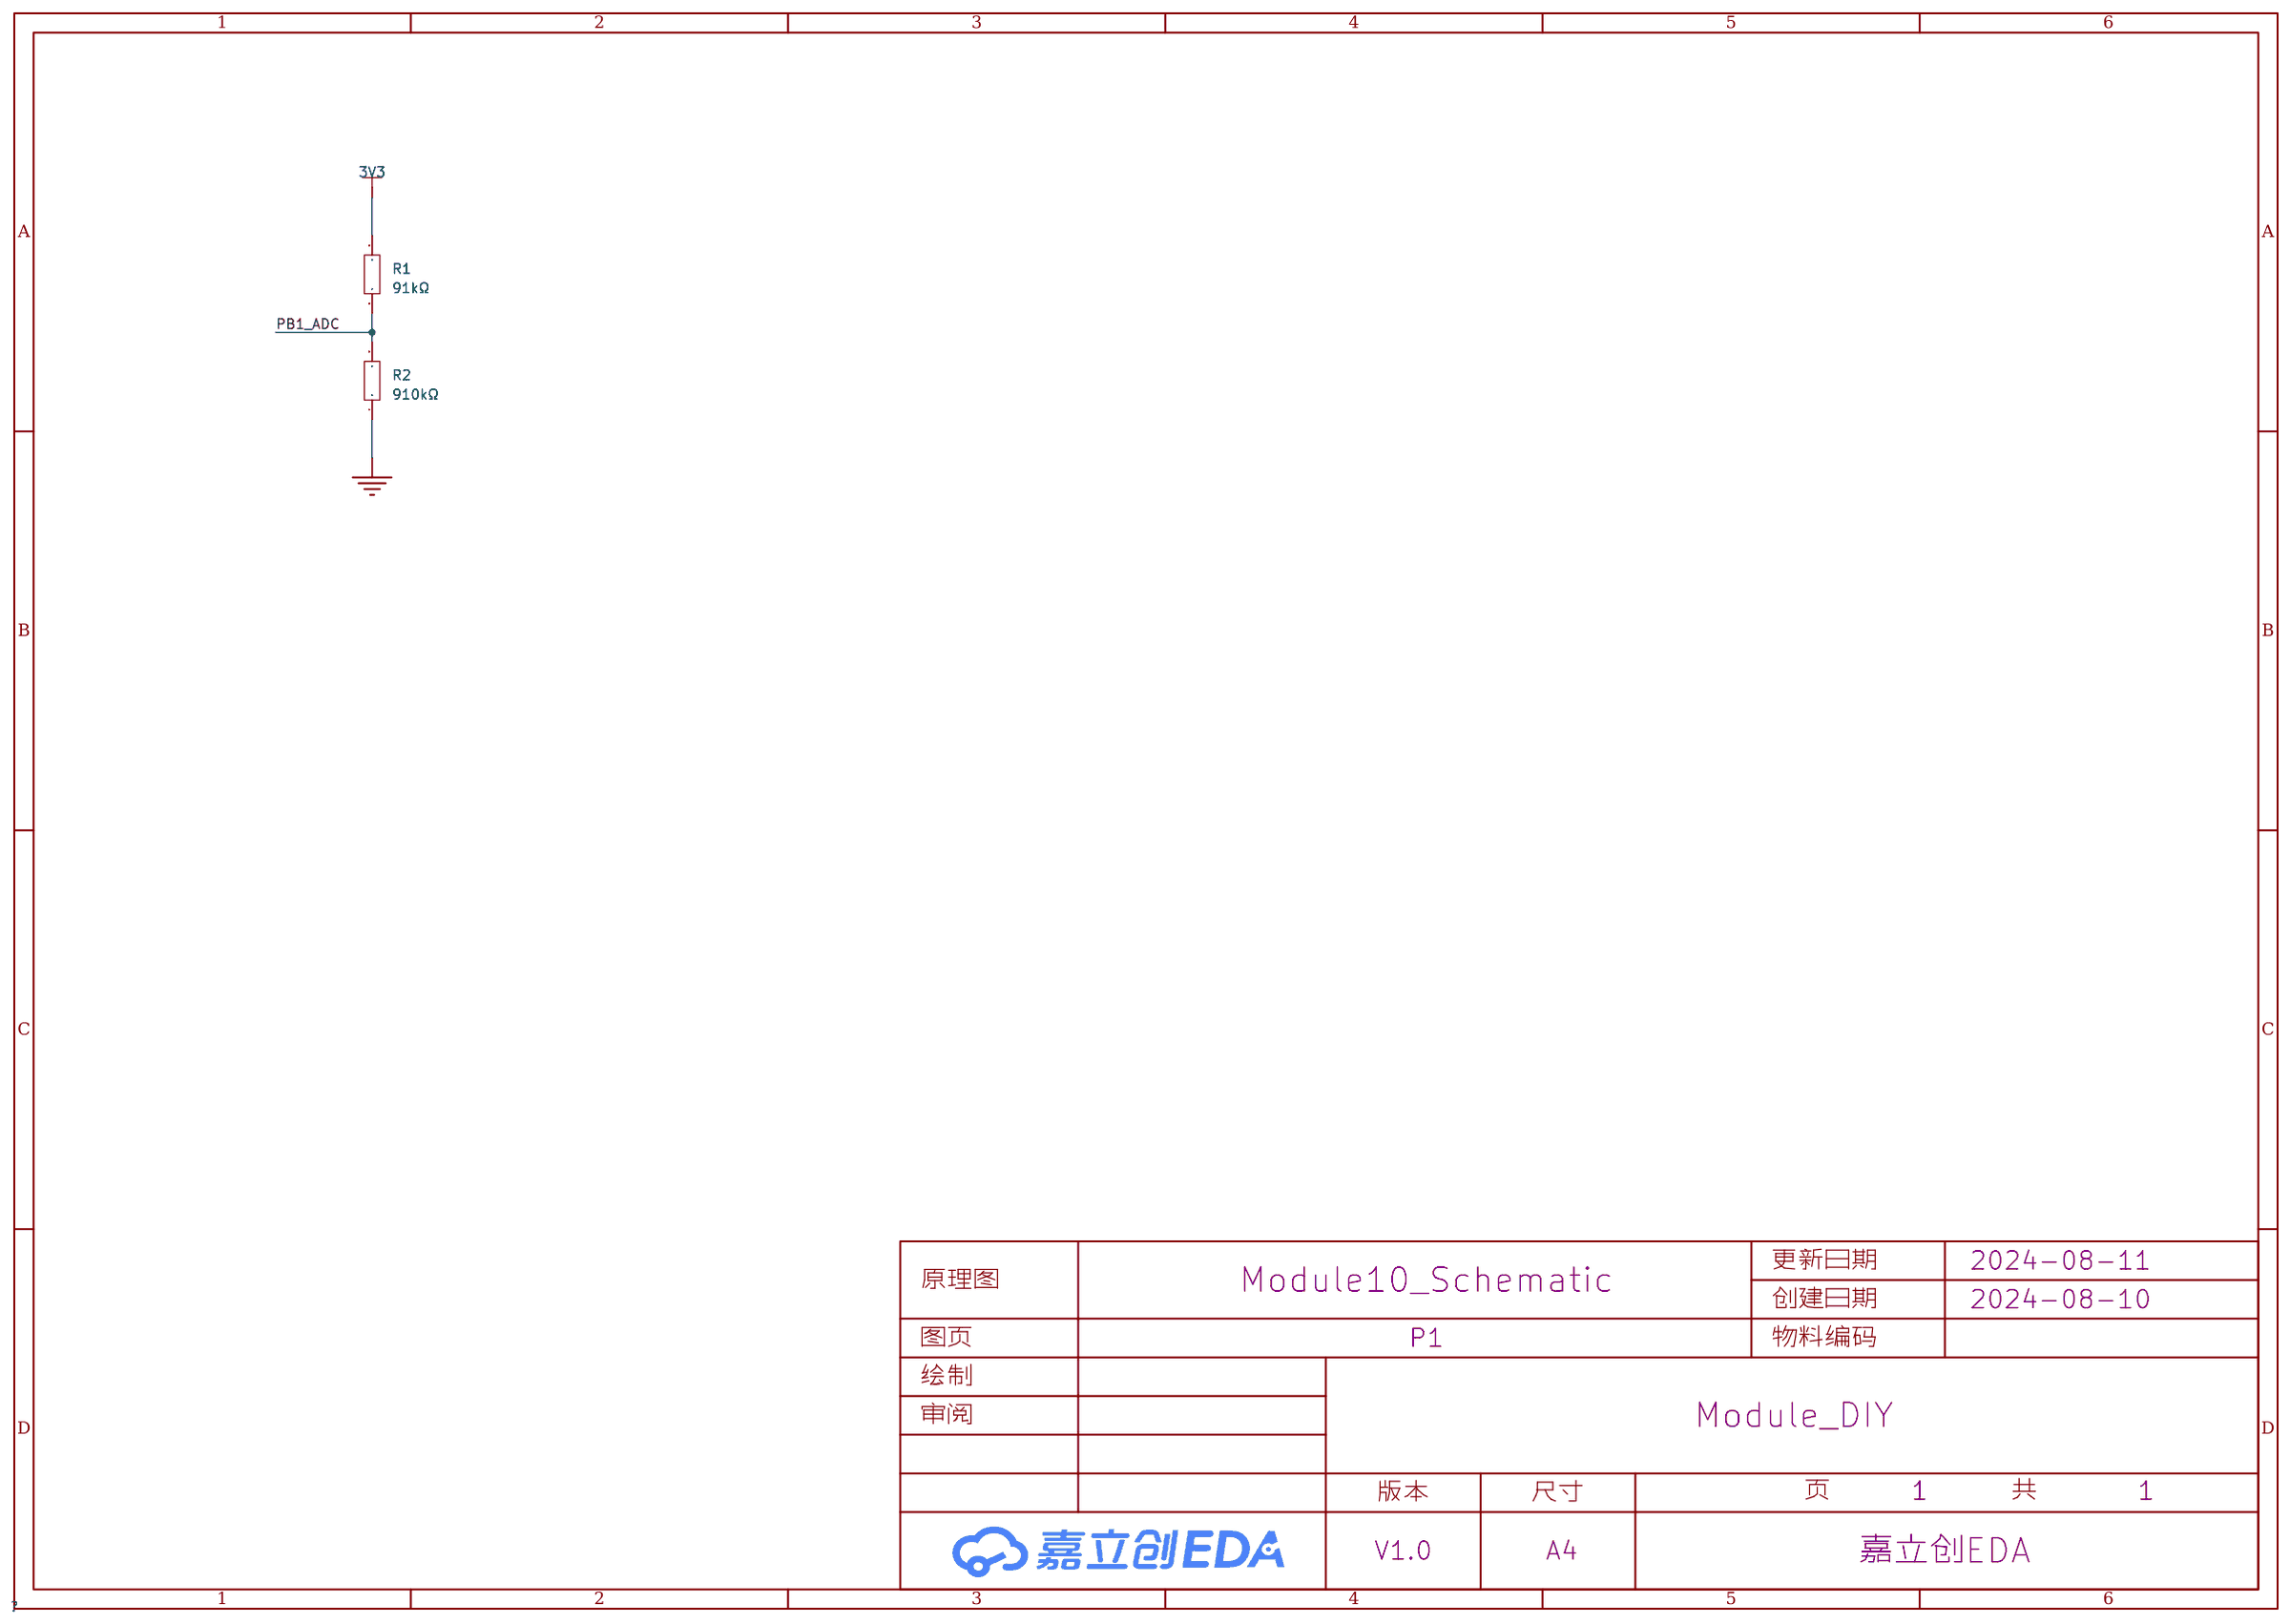
[diagram p6: schematic sheet]

## Parts
R1  91kΩ  [R0603]
R2  910kΩ  [R0603]

## Library data of the parts
R1 R2 = 0603WAF9103T5E: 电阻类型:厚膜电阻;阻值:910kΩ;精度:±1%;功率:100mW;最大工作电压:75V;温度系数:±100ppm/℃;; LCSC Part Name: 910kΩ ±1% 100mW 厚膜电阻; Supplier Part: C23263; Manufacturer: UNI-ROYAL(厚声); Supplier Footprint: 0603; JLCPCB Part Class: 扩展库; Datasheet: https://atta.szlcsc.com/upload/public/pdf/source/20200306/C422600_1E6D84923E4A46A82E41ADD87F860B5C.pdf; Supplier: LCSC; Type: 厚膜电阻; Tolerance: ±1%; Power(Watts): 100mW; Overload Voltage (Max): 75V; Temperature Coefficient: ±100ppm/℃; Operating Temperature Range: -55℃~+155℃

## Nets
3V3: R1.1
GND: R2.1
PB1_ADC: R1.2 R2.2

# Board Module4_PCB
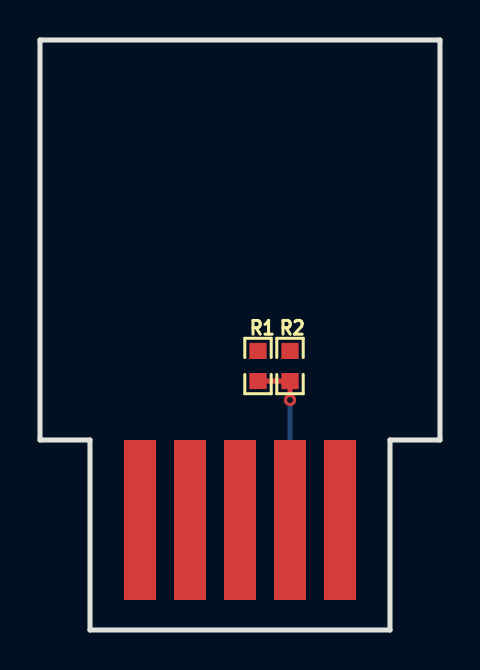
[diagram p7: board, top side]
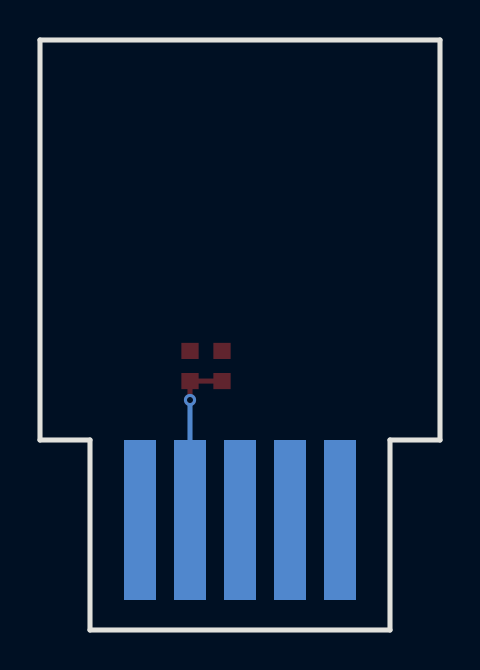
[diagram p8: board, bottom side, seen from below]

Outline 20 x 29.5 mm; copper layers: Top Layer, Bottom Layer. Coordinates in mm from the lower left corner of the outline.
Outline path: 0,29.5 0,9.5 2.5,9.5 2.5,0 17.5,0 17.5,9.5 20,9.5 20,29.5 0,29.5
Stack: Top Layer 0.035mm / Dielectric1 1.51mm FR4 er 4.5 / Bottom Layer 0.035mm

## Design rules (mm)
template: JLCPCB Capability(Two Layers Board)
spacing copperThickness1oz (default): track to track 0.102, other pairs 0.152 to 0.3
spacing copperThickness2oz: track to track 0.203, other pairs 0.152 to 0.3
track width copperThickness1oz (default): min 0.127, default 0.254, max 2.54
track width copperThickness2oz: min 0.203, default 0.254, max 2.54
differential pair differentialPair (default): width min 0.127, default 0.254, max 2.54; gap min 0.152, default 0.152
via viaSize (default): diameter min 0.5, default 0.61, max 10; hole min 0.3, default 0.305, max 6.3

## Placement (name value [footprint] x y rotation side)
NOREF  -  [Pad_e24]  7.5 5.5 0 top
NOREF#2  -  [Pad_e26]  12.5 5.5 0 top
NOREF#3  -  [Pad_e32]  5 5.5 0 top
NOREF#4  -  [Pad_e34]  10 5.5 0 top
NOREF#5  -  [Pad_e25]  10 5.5 0 top
NOREF#6  -  [Pad_e27]  15 5.5 0 top
NOREF#7  -  [Pad_e21]  5 5.5 0 top
NOREF#8  -  [Pad_e36]  15 5.5 0 top
NOREF#9  -  [Pad_e35]  12.5 5.5 0 top
NOREF#10  -  [Pad_e33]  7.5 5.5 0 top
R1  680kΩ  [R0603]  10.9 13.2 270 top
R2  330kΩ  [R0603]  12.5 13.2 270 top

## Footprints (pads in the part's own frame, mm; a bottom-side part is the same pattern mirrored in y, then rotated)
Pad_e21
  rect 1.6x8 smd: 1(0,0)
Pad_e24
  rect 1.6x8 smd: 1(0,0)
Pad_e25
  rect 1.6x8 smd: 1(0,0)
Pad_e26
  rect 1.6x8 smd: 1(0,0)
Pad_e27
  rect 1.6x8 smd: 1(0,0)
Pad_e32
  rect 1.6x8 smd far side: 1(0,0)
Pad_e33
  rect 1.6x8 smd far side: 1(0,0)
Pad_e34
  rect 1.6x8 smd far side: 1(0,0)
Pad_e35
  rect 1.6x8 smd far side: 1(0,0)
Pad_e36
  rect 1.6x8 smd far side: 1(0,0)
R0603
  rect 0.806x0.864 smd: 1(-0.753,0) 2(0.753,0)

## Nets
3V3: NOREF#7.1 R1.1
GND: NOREF#3.1 R2.1
PA4_CSS: NOREF.1
PA5_SCK: NOREF#10.1
PA6_MISO: NOREF#5.1
PA7_MOSI: NOREF#4.1
PB0_CUS: NOREF#8.1
PB1_ADC: NOREF#9.1 R1.2 R2.2
PB10_SCL_TX: NOREF#2.1
PB11_SDA_RX: NOREF#6.1

## Via types
v1: diameter 0.61, hole 0.305, Top Layer to Bottom Layer, 1 via

## Routing (per net, layer and track width the routed paths; a pad name or vN(x,y) marks a point on that pad's centre or on a via; arc(x,y) is an arc through that point)
PB1_ADC: length 8.5
  Top Layer w0.254: R1.2 R2.2 v1(12.5,11.5)
  Bottom Layer w0.254: v1(12.5,11.5) NOREF#9.1

# Board Module5_PCB
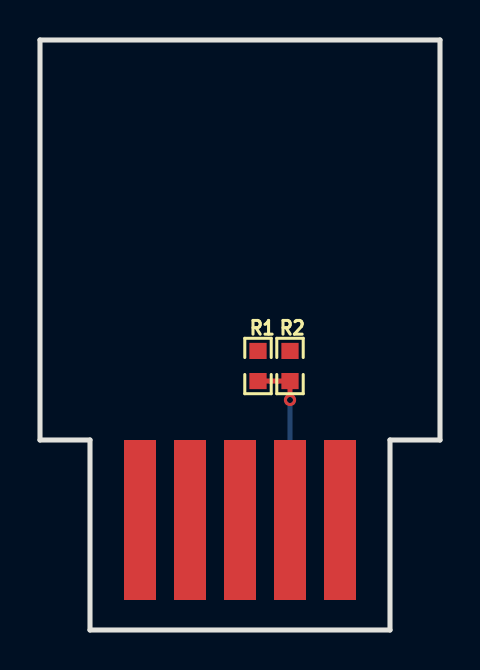
[diagram p9: board, top side]
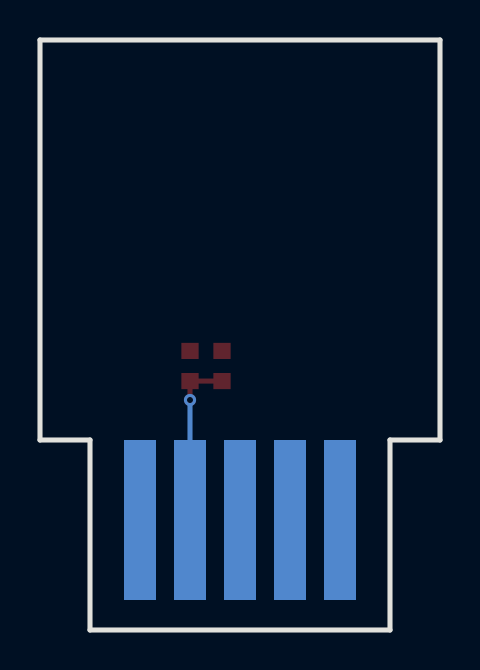
[diagram p10: board, bottom side, seen from below]

Outline 20 x 29.5 mm; copper layers: Top Layer, Bottom Layer. Coordinates in mm from the lower left corner of the outline.
Outline path: 0,29.5 0,9.5 2.5,9.5 2.5,0 17.5,0 17.5,9.5 20,9.5 20,29.5 0,29.5
Stack: Top Layer 0.035mm / Dielectric1 1.51mm FR4 er 4.5 / Bottom Layer 0.035mm

## Design rules (mm)
template: JLCPCB Capability(Two Layers Board)
spacing copperThickness1oz (default): track to track 0.102, other pairs 0.152 to 0.3
spacing copperThickness2oz: track to track 0.203, other pairs 0.152 to 0.3
track width copperThickness1oz (default): min 0.127, default 0.254, max 2.54
track width copperThickness2oz: min 0.203, default 0.254, max 2.54
differential pair differentialPair (default): width min 0.127, default 0.254, max 2.54; gap min 0.152, default 0.152
via viaSize (default): diameter min 0.5, default 0.61, max 10; hole min 0.3, default 0.305, max 6.3

## Placement (name value [footprint] x y rotation side)
NOREF  -  [Pad_e21]  5 5.5 0 top
NOREF#2  -  [Pad_e25]  10 5.5 0 top
NOREF#3  -  [Pad_e24]  7.5 5.5 0 top
NOREF#4  -  [Pad_e26]  12.5 5.5 0 top
NOREF#5  -  [Pad_e35]  12.5 5.5 0 top
NOREF#6  -  [Pad_e33]  7.5 5.5 0 top
NOREF#7  -  [Pad_e32]  5 5.5 0 top
NOREF#8  -  [Pad_e27]  15 5.5 0 top
NOREF#9  -  [Pad_e34]  10 5.5 0 top
NOREF#10  -  [Pad_e36]  15 5.5 0 top
R1  499kΩ  [R0603]  10.9 13.2 270 top
R2  499kΩ  [R0603]  12.5 13.2 270 top

## Footprints (pads in the part's own frame, mm; a bottom-side part is the same pattern mirrored in y, then rotated)
Pad_e21
  rect 1.6x8 smd: 1(0,0)
Pad_e24
  rect 1.6x8 smd: 1(0,0)
Pad_e25
  rect 1.6x8 smd: 1(0,0)
Pad_e26
  rect 1.6x8 smd: 1(0,0)
Pad_e27
  rect 1.6x8 smd: 1(0,0)
Pad_e32
  rect 1.6x8 smd far side: 1(0,0)
Pad_e33
  rect 1.6x8 smd far side: 1(0,0)
Pad_e34
  rect 1.6x8 smd far side: 1(0,0)
Pad_e35
  rect 1.6x8 smd far side: 1(0,0)
Pad_e36
  rect 1.6x8 smd far side: 1(0,0)
R0603
  rect 0.806x0.864 smd: 1(-0.753,0) 2(0.753,0)

## Nets
3V3: NOREF.1 R1.1
GND: NOREF#7.1 R2.1
PA4_CSS: NOREF#3.1
PA5_SCK: NOREF#6.1
PA6_MISO: NOREF#2.1
PA7_MOSI: NOREF#9.1
PB0_CUS: NOREF#10.1
PB1_ADC: NOREF#5.1 R1.2 R2.2
PB10_SCL_TX: NOREF#4.1
PB11_SDA_RX: NOREF#8.1

## Via types
v1: diameter 0.61, hole 0.305, Top Layer to Bottom Layer, 1 via

## Routing (per net, layer and track width the routed paths; a pad name or vN(x,y) marks a point on that pad's centre or on a via; arc(x,y) is an arc through that point)
PB1_ADC: length 8.5
  Top Layer w0.254: R1.2 R2.2 v1(12.5,11.5)
  Bottom Layer w0.254: v1(12.5,11.5) NOREF#5.1

# Board Module6_PCB
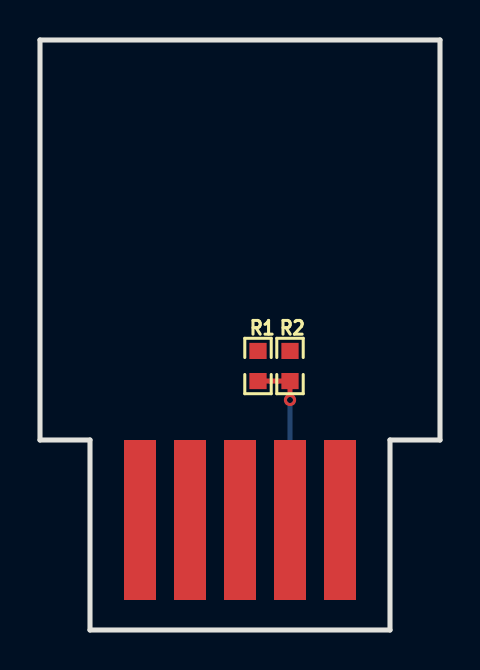
[diagram p11: board, top side]
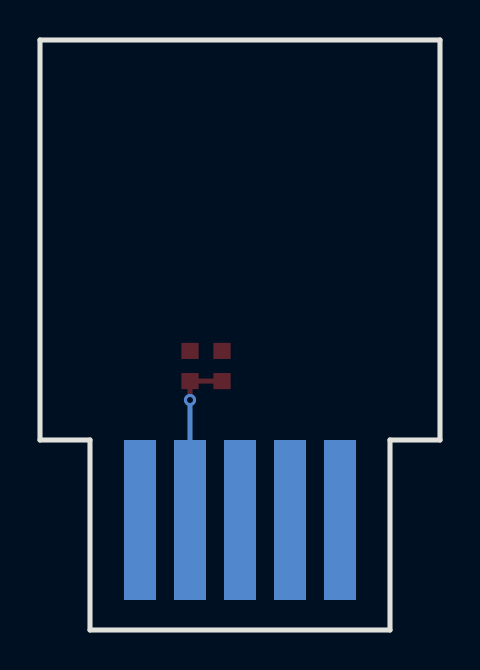
[diagram p12: board, bottom side, seen from below]

Outline 20 x 29.5 mm; copper layers: Top Layer, Bottom Layer. Coordinates in mm from the lower left corner of the outline.
Outline path: 0,29.5 0,9.5 2.5,9.5 2.5,0 17.5,0 17.5,9.5 20,9.5 20,29.5 0,29.5
Stack: Top Layer 0.035mm / Dielectric1 1.51mm FR4 er 4.5 / Bottom Layer 0.035mm

## Design rules (mm)
template: JLCPCB Capability(Two Layers Board)
spacing copperThickness1oz (default): track to track 0.102, other pairs 0.152 to 0.3
spacing copperThickness2oz: track to track 0.203, other pairs 0.152 to 0.3
track width copperThickness1oz (default): min 0.127, default 0.254, max 2.54
track width copperThickness2oz: min 0.203, default 0.254, max 2.54
differential pair differentialPair (default): width min 0.127, default 0.254, max 2.54; gap min 0.152, default 0.152
via viaSize (default): diameter min 0.5, default 0.61, max 10; hole min 0.3, default 0.305, max 6.3

## Placement (name value [footprint] x y rotation side)
NOREF  -  [Pad_e21]  5 5.5 0 top
NOREF#2  -  [Pad_e24]  7.5 5.5 0 top
NOREF#3  -  [Pad_e36]  15 5.5 0 top
NOREF#4  -  [Pad_e33]  7.5 5.5 0 top
NOREF#5  -  [Pad_e32]  5 5.5 0 top
NOREF#6  -  [Pad_e27]  15 5.5 0 top
NOREF#7  -  [Pad_e34]  10 5.5 0 top
NOREF#8  -  [Pad_e35]  12.5 5.5 0 top
NOREF#9  -  [Pad_e25]  10 5.5 0 top
NOREF#10  -  [Pad_e26]  12.5 5.5 0 top
R1  390kΩ  [R0603]  10.9 13.2 270 top
R2  620kΩ  [R0603]  12.5 13.2 270 top

## Footprints (pads in the part's own frame, mm; a bottom-side part is the same pattern mirrored in y, then rotated)
Pad_e21
  rect 1.6x8 smd: 1(0,0)
Pad_e24
  rect 1.6x8 smd: 1(0,0)
Pad_e25
  rect 1.6x8 smd: 1(0,0)
Pad_e26
  rect 1.6x8 smd: 1(0,0)
Pad_e27
  rect 1.6x8 smd: 1(0,0)
Pad_e32
  rect 1.6x8 smd far side: 1(0,0)
Pad_e33
  rect 1.6x8 smd far side: 1(0,0)
Pad_e34
  rect 1.6x8 smd far side: 1(0,0)
Pad_e35
  rect 1.6x8 smd far side: 1(0,0)
Pad_e36
  rect 1.6x8 smd far side: 1(0,0)
R0603
  rect 0.806x0.864 smd: 1(-0.753,0) 2(0.753,0)

## Nets
3V3: NOREF.1 R1.1
GND: NOREF#5.1 R2.1
PA4_CSS: NOREF#2.1
PA5_SCK: NOREF#4.1
PA6_MISO: NOREF#9.1
PA7_MOSI: NOREF#7.1
PB0_CUS: NOREF#3.1
PB1_ADC: NOREF#8.1 R1.2 R2.2
PB10_SCL_TX: NOREF#10.1
PB11_SDA_RX: NOREF#6.1

## Via types
v1: diameter 0.61, hole 0.305, Top Layer to Bottom Layer, 1 via

## Routing (per net, layer and track width the routed paths; a pad name or vN(x,y) marks a point on that pad's centre or on a via; arc(x,y) is an arc through that point)
PB1_ADC: length 8.5
  Top Layer w0.254: R1.2 R2.2 v1(12.5,11.5)
  Bottom Layer w0.254: v1(12.5,11.5) NOREF#8.1

# Board Module7_PCB
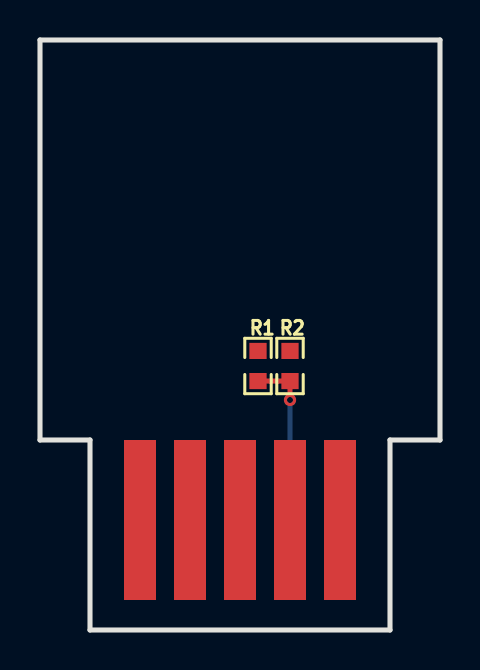
[diagram p13: board, top side]
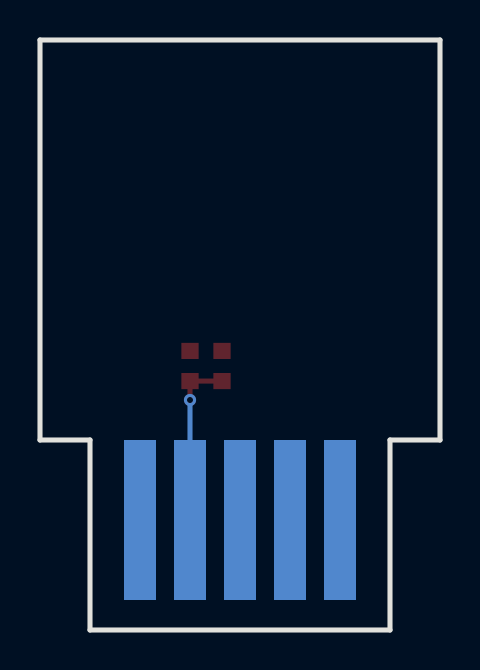
[diagram p14: board, bottom side, seen from below]

Outline 20 x 29.5 mm; copper layers: Top Layer, Bottom Layer. Coordinates in mm from the lower left corner of the outline.
Outline path: 0,29.5 0,9.5 2.5,9.5 2.5,0 17.5,0 17.5,9.5 20,9.5 20,29.5 0,29.5
Stack: Top Layer 0.035mm / Dielectric1 1.51mm FR4 er 4.5 / Bottom Layer 0.035mm

## Design rules (mm)
template: JLCPCB Capability(Two Layers Board)
spacing copperThickness1oz (default): track to track 0.102, other pairs 0.152 to 0.3
spacing copperThickness2oz: track to track 0.203, other pairs 0.152 to 0.3
track width copperThickness1oz (default): min 0.127, default 0.254, max 2.54
track width copperThickness2oz: min 0.203, default 0.254, max 2.54
differential pair differentialPair (default): width min 0.127, default 0.254, max 2.54; gap min 0.152, default 0.152
via viaSize (default): diameter min 0.5, default 0.61, max 10; hole min 0.3, default 0.305, max 6.3

## Placement (name value [footprint] x y rotation side)
NOREF  -  [Pad_e33]  7.5 5.5 0 top
NOREF#2  -  [Pad_e35]  12.5 5.5 0 top
NOREF#3  -  [Pad_e26]  12.5 5.5 0 top
NOREF#4  -  [Pad_e36]  15 5.5 0 top
NOREF#5  -  [Pad_e34]  10 5.5 0 top
NOREF#6  -  [Pad_e25]  10 5.5 0 top
NOREF#7  -  [Pad_e32]  5 5.5 0 top
NOREF#8  -  [Pad_e27]  15 5.5 0 top
NOREF#9  -  [Pad_e21]  5 5.5 0 top
NOREF#10  -  [Pad_e24]  7.5 5.5 0 top
R1  330kΩ  [R0603]  10.9 13.2 270 top
R2  680kΩ  [R0603]  12.5 13.2 270 top

## Footprints (pads in the part's own frame, mm; a bottom-side part is the same pattern mirrored in y, then rotated)
Pad_e21
  rect 1.6x8 smd: 1(0,0)
Pad_e24
  rect 1.6x8 smd: 1(0,0)
Pad_e25
  rect 1.6x8 smd: 1(0,0)
Pad_e26
  rect 1.6x8 smd: 1(0,0)
Pad_e27
  rect 1.6x8 smd: 1(0,0)
Pad_e32
  rect 1.6x8 smd far side: 1(0,0)
Pad_e33
  rect 1.6x8 smd far side: 1(0,0)
Pad_e34
  rect 1.6x8 smd far side: 1(0,0)
Pad_e35
  rect 1.6x8 smd far side: 1(0,0)
Pad_e36
  rect 1.6x8 smd far side: 1(0,0)
R0603
  rect 0.806x0.864 smd: 1(-0.753,0) 2(0.753,0)

## Nets
3V3: NOREF#9.1 R1.1
GND: NOREF#7.1 R2.1
PA4_CSS: NOREF#10.1
PA5_SCK: NOREF.1
PA6_MISO: NOREF#6.1
PA7_MOSI: NOREF#5.1
PB0_CUS: NOREF#4.1
PB1_ADC: NOREF#2.1 R1.2 R2.2
PB10_SCL_TX: NOREF#3.1
PB11_SDA_RX: NOREF#8.1

## Via types
v1: diameter 0.61, hole 0.305, Top Layer to Bottom Layer, 1 via

## Routing (per net, layer and track width the routed paths; a pad name or vN(x,y) marks a point on that pad's centre or on a via; arc(x,y) is an arc through that point)
PB1_ADC: length 8.5
  Top Layer w0.254: v1(12.5,11.5) R2.2 R1.2
  Bottom Layer w0.254: v1(12.5,11.5) NOREF#2.1

# Board Module8_PCB
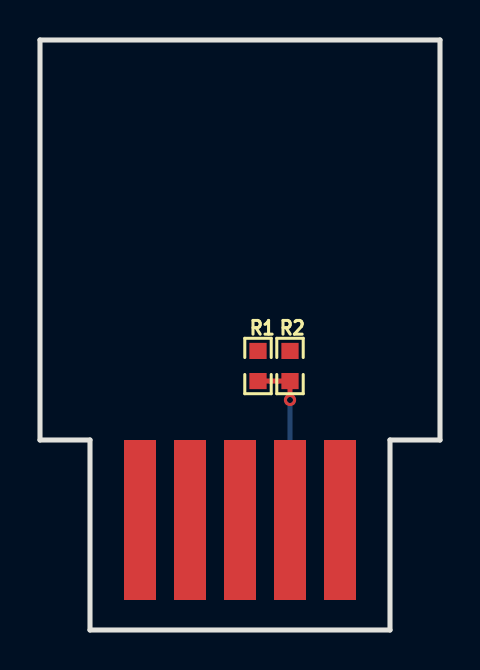
[diagram p15: board, top side]
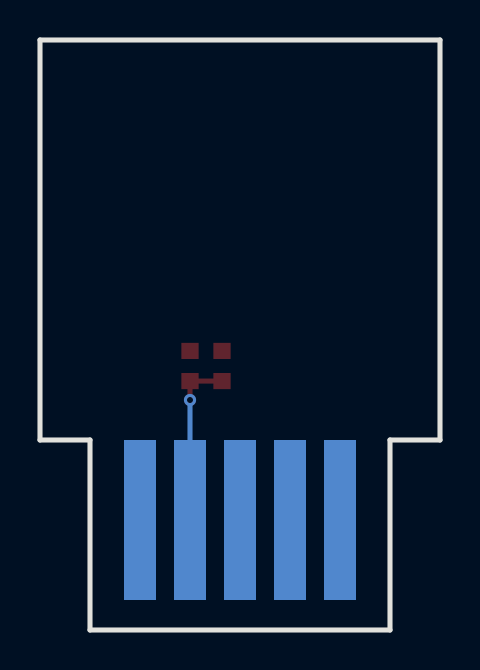
[diagram p16: board, bottom side, seen from below]

Outline 20 x 29.5 mm; copper layers: Top Layer, Bottom Layer. Coordinates in mm from the lower left corner of the outline.
Outline path: 0,29.5 0,9.5 2.5,9.5 2.5,0 17.5,0 17.5,9.5 20,9.5 20,29.5 0,29.5
Stack: Top Layer 0.035mm / Dielectric1 1.51mm FR4 er 4.5 / Bottom Layer 0.035mm

## Design rules (mm)
template: JLCPCB Capability(Two Layers Board)
spacing copperThickness1oz (default): track to track 0.102, other pairs 0.152 to 0.3
spacing copperThickness2oz: track to track 0.203, other pairs 0.152 to 0.3
track width copperThickness1oz (default): min 0.127, default 0.254, max 2.54
track width copperThickness2oz: min 0.203, default 0.254, max 2.54
differential pair differentialPair (default): width min 0.127, default 0.254, max 2.54; gap min 0.152, default 0.152
via viaSize (default): diameter min 0.5, default 0.61, max 10; hole min 0.3, default 0.305, max 6.3

## Placement (name value [footprint] x y rotation side)
NOREF  -  [Pad_e25]  10 5.5 0 top
NOREF#2  -  [Pad_e24]  7.5 5.5 0 top
NOREF#3  -  [Pad_e34]  10 5.5 0 top
NOREF#4  -  [Pad_e26]  12.5 5.5 0 top
NOREF#5  -  [Pad_e32]  5 5.5 0 top
NOREF#6  -  [Pad_e36]  15 5.5 0 top
NOREF#7  -  [Pad_e21]  5 5.5 0 top
NOREF#8  -  [Pad_e33]  7.5 5.5 0 top
NOREF#9  -  [Pad_e35]  12.5 5.5 0 top
NOREF#10  -  [Pad_e27]  15 5.5 0 top
R1  240kΩ  [R0603]  10.9 13.2 270 top
R2  750kΩ  [R0603]  12.5 13.2 270 top

## Footprints (pads in the part's own frame, mm; a bottom-side part is the same pattern mirrored in y, then rotated)
Pad_e21
  rect 1.6x8 smd: 1(0,0)
Pad_e24
  rect 1.6x8 smd: 1(0,0)
Pad_e25
  rect 1.6x8 smd: 1(0,0)
Pad_e26
  rect 1.6x8 smd: 1(0,0)
Pad_e27
  rect 1.6x8 smd: 1(0,0)
Pad_e32
  rect 1.6x8 smd far side: 1(0,0)
Pad_e33
  rect 1.6x8 smd far side: 1(0,0)
Pad_e34
  rect 1.6x8 smd far side: 1(0,0)
Pad_e35
  rect 1.6x8 smd far side: 1(0,0)
Pad_e36
  rect 1.6x8 smd far side: 1(0,0)
R0603
  rect 0.806x0.864 smd: 1(-0.753,0) 2(0.753,0)

## Nets
3V3: NOREF#7.1 R1.1
GND: NOREF#5.1 R2.1
PA4_CSS: NOREF#2.1
PA5_SCK: NOREF#8.1
PA6_MISO: NOREF.1
PA7_MOSI: NOREF#3.1
PB0_CUS: NOREF#6.1
PB1_ADC: NOREF#9.1 R1.2 R2.2
PB10_SCL_TX: NOREF#4.1
PB11_SDA_RX: NOREF#10.1

## Via types
v1: diameter 0.61, hole 0.305, Top Layer to Bottom Layer, 1 via

## Routing (per net, layer and track width the routed paths; a pad name or vN(x,y) marks a point on that pad's centre or on a via; arc(x,y) is an arc through that point)
PB1_ADC: length 8.5
  Top Layer w0.254: v1(12.5,11.5) R2.2 R1.2
  Bottom Layer w0.254: v1(12.5,11.5) NOREF#9.1
